# Altium project LIDO-HW_2022-04_V01.PrjPcb
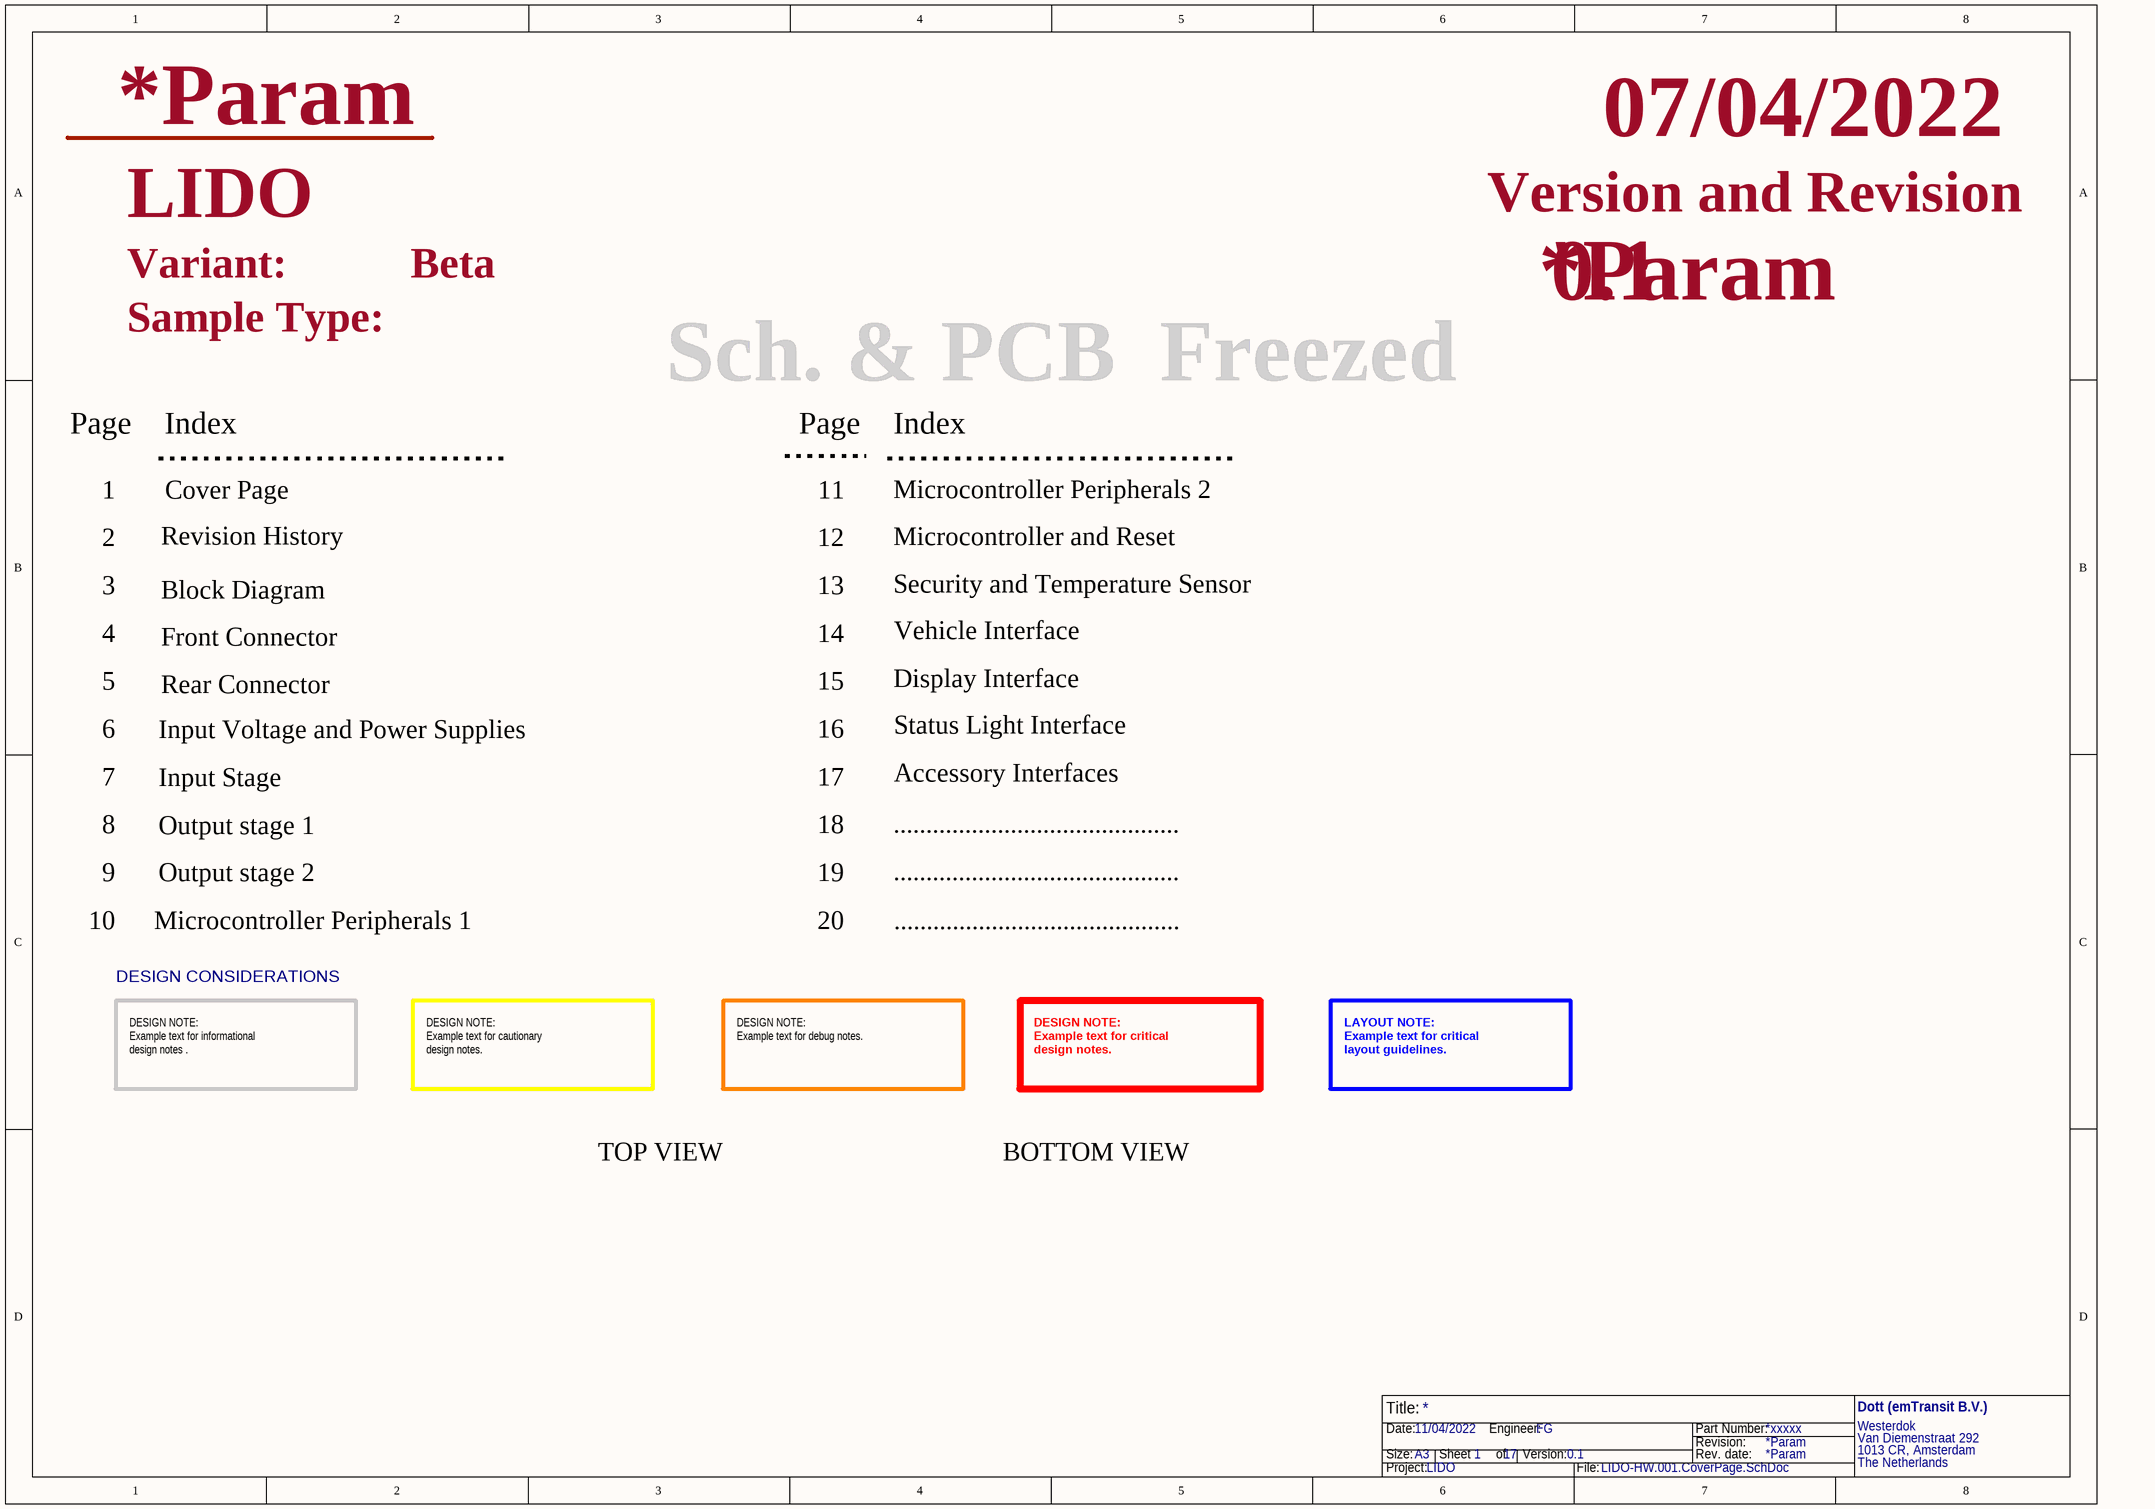
[diagram p0: LIDO-HW.001.CoverPage.SchDoc]
Company_Name: Dott (emTransit B.V.); CompanyAddress1: Westerdok; CompanyAddress2: Van Diemenstraat 292; CompanyAddress3: 1013 CR, Amsterdam; CompanyAddress4: The Netherlands; HardwareDesigner: FG; HardwareDesignerAbb: *Param; MainProjectName: *Param; PopulateLabel: *Param; Project_Version: 0.1; Project_VersionDate: 11/04/2022; ProjectBoardName: LIDO; ProjectNumber: *xxxxx; ProjectRevision: *Param; ProjectRevisionDate: *Param; ProjectStartDate: 07/04/2022; ProjectVariant: Beta; ReleaseDate: *Param; Reviewer: *Param; ReviewerAbb: *Param
14 sheets, 260 parts. Net scope: flat (ports and power ports of the same name join across sheets).
Board file: LIDO-HW_2022-04_V01.PcbDoc
Sheets:
  LIDO-HW.001.CoverPage.SchDoc
  LIDO-HW.002.BlockDiagram.SchDoc
  LIDO-HW.003.RevisionHistory.SchDoc
  LIDO-HW.004.RevisionHistory.SchDoc
  LIDO-HW.100.Connectors_1.SchDoc
  LIDO-HW.100.Connectors_2.SchDoc
  LIDO-HW.100.Page_3.SchDoc
  LIDO-HW.100.Page_4.SchDoc
  LIDO-HW.100.Page_5.SchDoc
  LIDO-HW.100.Page_6.SchDoc
  LIDO-HW.100.Page_7.SchDoc
  LIDO-HW.100.Page_8.SchDoc
  LIDO-HW.100.Page_9.SchDoc
  LIDO-HW.100.Page_10.SchDoc

## Sheet LIDO-HW.001.CoverPage.SchDoc
size A3; CompanyName: EST-Floattech; DrawnBy: RR; Organization: EST-Floattech; Address2: Zandsteen 1; Address3: 2132 MZ; Address4: Hoofddorp; DocumentNumber: 21xxx; Revision: 1.0; SheetNumber: 1; SheetTotal: 17

### Notes on the sheet
- Version and Revision
- Variant:
- Sample Type:
- Page
- Index
- Sch. & PCB  Freezed
- 1
- Cover Page
- 11
- Microcontroller Peripherals 2
- 2
- Revision History
- 12
- Microcontroller and Reset
- 3
- 4
- Block Diagram
- Front Connector
- 13
- 14
- Security and Temperature Sensor
- Vehicle Interface
- 5
- Rear Connector
- 15
- Display Interface
- 6
- 7
- Input Voltage and Power Supplies
- Input Stage
- 16
- 17
- Status Light Interface
- Accessory Interfaces
- 8
- Output stage 1
- 18
- ............................................
- 9
- Output stage 2
- 19
- DESIGN CONSIDERATIONS
- 10
- Microcontroller Peripherals 1
- 20
- DESIGN NOTE:
  Example text for informational
  design notes .
- DESIGN NOTE:
  Example text for cautionary
  design notes.
- DESIGN NOTE:
  Example text for debug notes.
- DESIGN NOTE:
  Example text for critical
  design notes.
- LAYOUT NOTE:
  Example text for critical
  layout guidelines.
- TOP VIEW
- BOTTOM VIEW
- Title:
- Size:
- Date:
- A3
- Sheet       of
- Engineer:
- Version:
- Part Number:
- Revision:
- Rev. date:
- Project:
- File:

## Sheet LIDO-HW.002.BlockDiagram.SchDoc
size A3; CompanyName: EST-Floattech; DrawnBy: RR; Organization: EST-Floattech; Address2: Zandsteen 1; Address3: 2132 MZ; Address4: Hoofddorp; DocumentNumber: 21xxx; Revision: 1.0; SheetNumber: 2; SheetTotal: 18
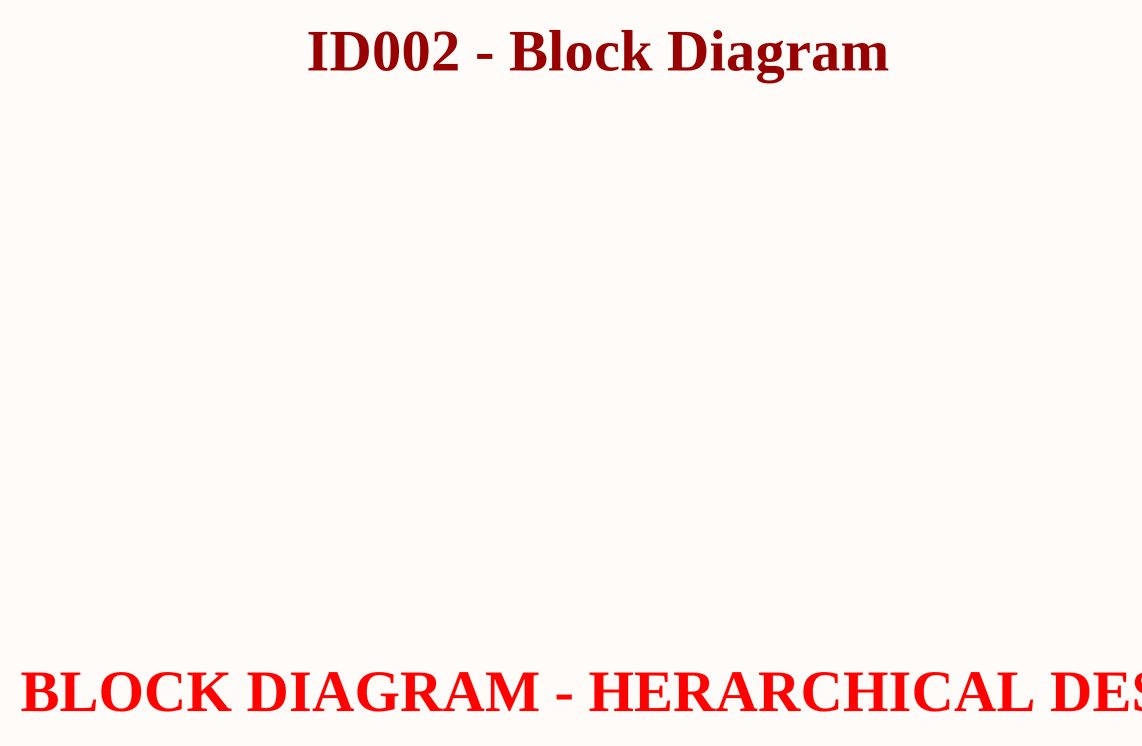
[diagram p1: LIDO-HW.002.BlockDiagram.SchDoc]

### Notes on the sheet
- ID002 - Block Diagram
- BLOCK DIAGRAM - HERARCHICAL DESIGN
- Title:
- Size:
- Date:
- A3
- Sheet       of
- Engineer:
- Version:
- Part Number:
- Revision:
- Rev. date:
- Project:
- File:

## Sheet LIDO-HW.003.RevisionHistory.SchDoc
size A3; CompanyName: EST-Floattech; DrawnBy: RR; Organization: EST-Floattech; Address2: Zandsteen 1; Address3: 2132 MZ; Address4: Hoofddorp; DocumentNumber: 21xxx; Revision: 1.0; SheetNumber: 3; SheetTotal: 18
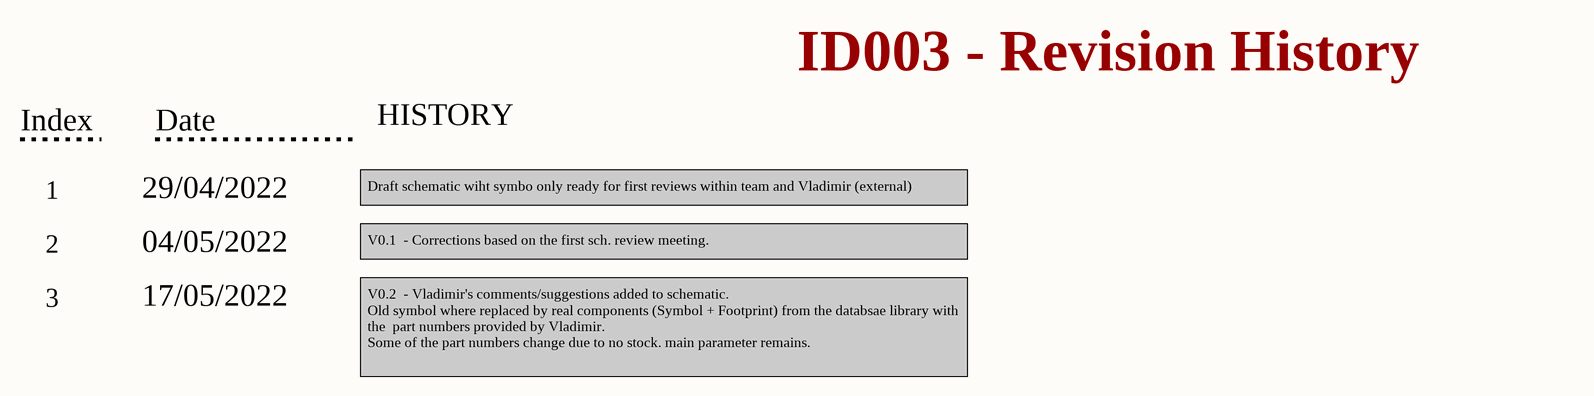
[diagram p2: LIDO-HW.003.RevisionHistory.SchDoc]

### Notes on the sheet
- Index
- Date
- HISTORY
- ID003 - Revision History
- 1
- 29/04/2022
- Draft schematic wiht symbo only ready for first reviews within team and Vladimir (external)
- 2
- 04/05/2022
- V0.1  - Corrections based on the first sch. review meeting.
- 3
- 17/05/2022
- V0.2  - Vladimir's comments/suggestions added to schematic.
  Old symbol where replaced by real components (Symbol + Footprint) from the databsae library with the  part numbers provided by Vladimir.
  Some of the part numbers change due to no stock. main parameter remains.
- Title:
- Size:
- Date:
- A3
- Sheet       of
- Engineer:
- Version:
- Part Number:
- Revision:
- Rev. date:
- Project:
- File:

## Sheet LIDO-HW.004.RevisionHistory.SchDoc
size A3; CompanyName: EST-Floattech; DrawnBy: RR; Organization: EST-Floattech; Address2: Zandsteen 1; Address3: 2132 MZ; Address4: Hoofddorp; DocumentNumber: 21xxx; Revision: 1.0; SheetNumber: 4; SheetTotal: 4
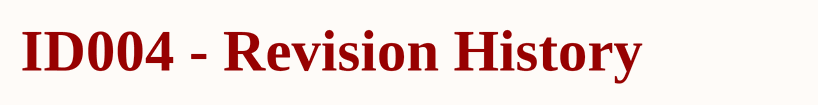
[diagram p3: LIDO-HW.004.RevisionHistory.SchDoc]

### Notes on the sheet
- ID004 - Revision History
- Title:
- Size:
- Date:
- A3
- Sheet       of
- Engineer:
- Version:
- Part Number:
- Revision:
- Rev. date:
- Project:
- File:

## Sheet LIDO-HW.100.Connectors_1.SchDoc
size A3; SheetNumber: 5; SheetTotal: 5
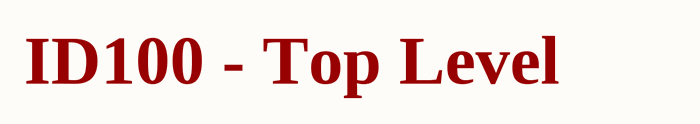
[diagram p4: LIDO-HW.100.Connectors_1.SchDoc]

### Notes on the sheet
- ID100 - Top Level
- Title:
- Size:
- Date:
- A3
- Sheet       of
- Engineer:
- Version:
- Part Number:
- Revision:
- Rev. date:
- Project:
- File:

## Sheet LIDO-HW.100.Connectors_2.SchDoc
size A3; SheetNumber: 6; SheetTotal: 6

### Notes on the sheet
- Title:
- Size:
- Date:
- A3
- Sheet       of
- Engineer:
- Version:
- Part Number:
- Revision:
- Rev. date:
- Project:
- File:

## Sheet LIDO-HW.100.Page_3.SchDoc
size A3; SheetNumber: 7; SheetTotal: 7

### Notes on the sheet
- Title:
- Size:
- Date:
- A3
- Sheet       of
- Engineer:
- Version:
- Part Number:
- Revision:
- Rev. date:
- Project:
- File:

## Sheet LIDO-HW.100.Page_4.SchDoc
size A3; SheetNumber: 8; SheetTotal: 8

### Notes on the sheet
- Title:
- Size:
- Date:
- A3
- Sheet       of
- Engineer:
- Version:
- Part Number:
- Revision:
- Rev. date:
- Project:
- File:

## Sheet LIDO-HW.100.Page_5.SchDoc
size A3; SheetNumber: 9; SheetTotal: 14
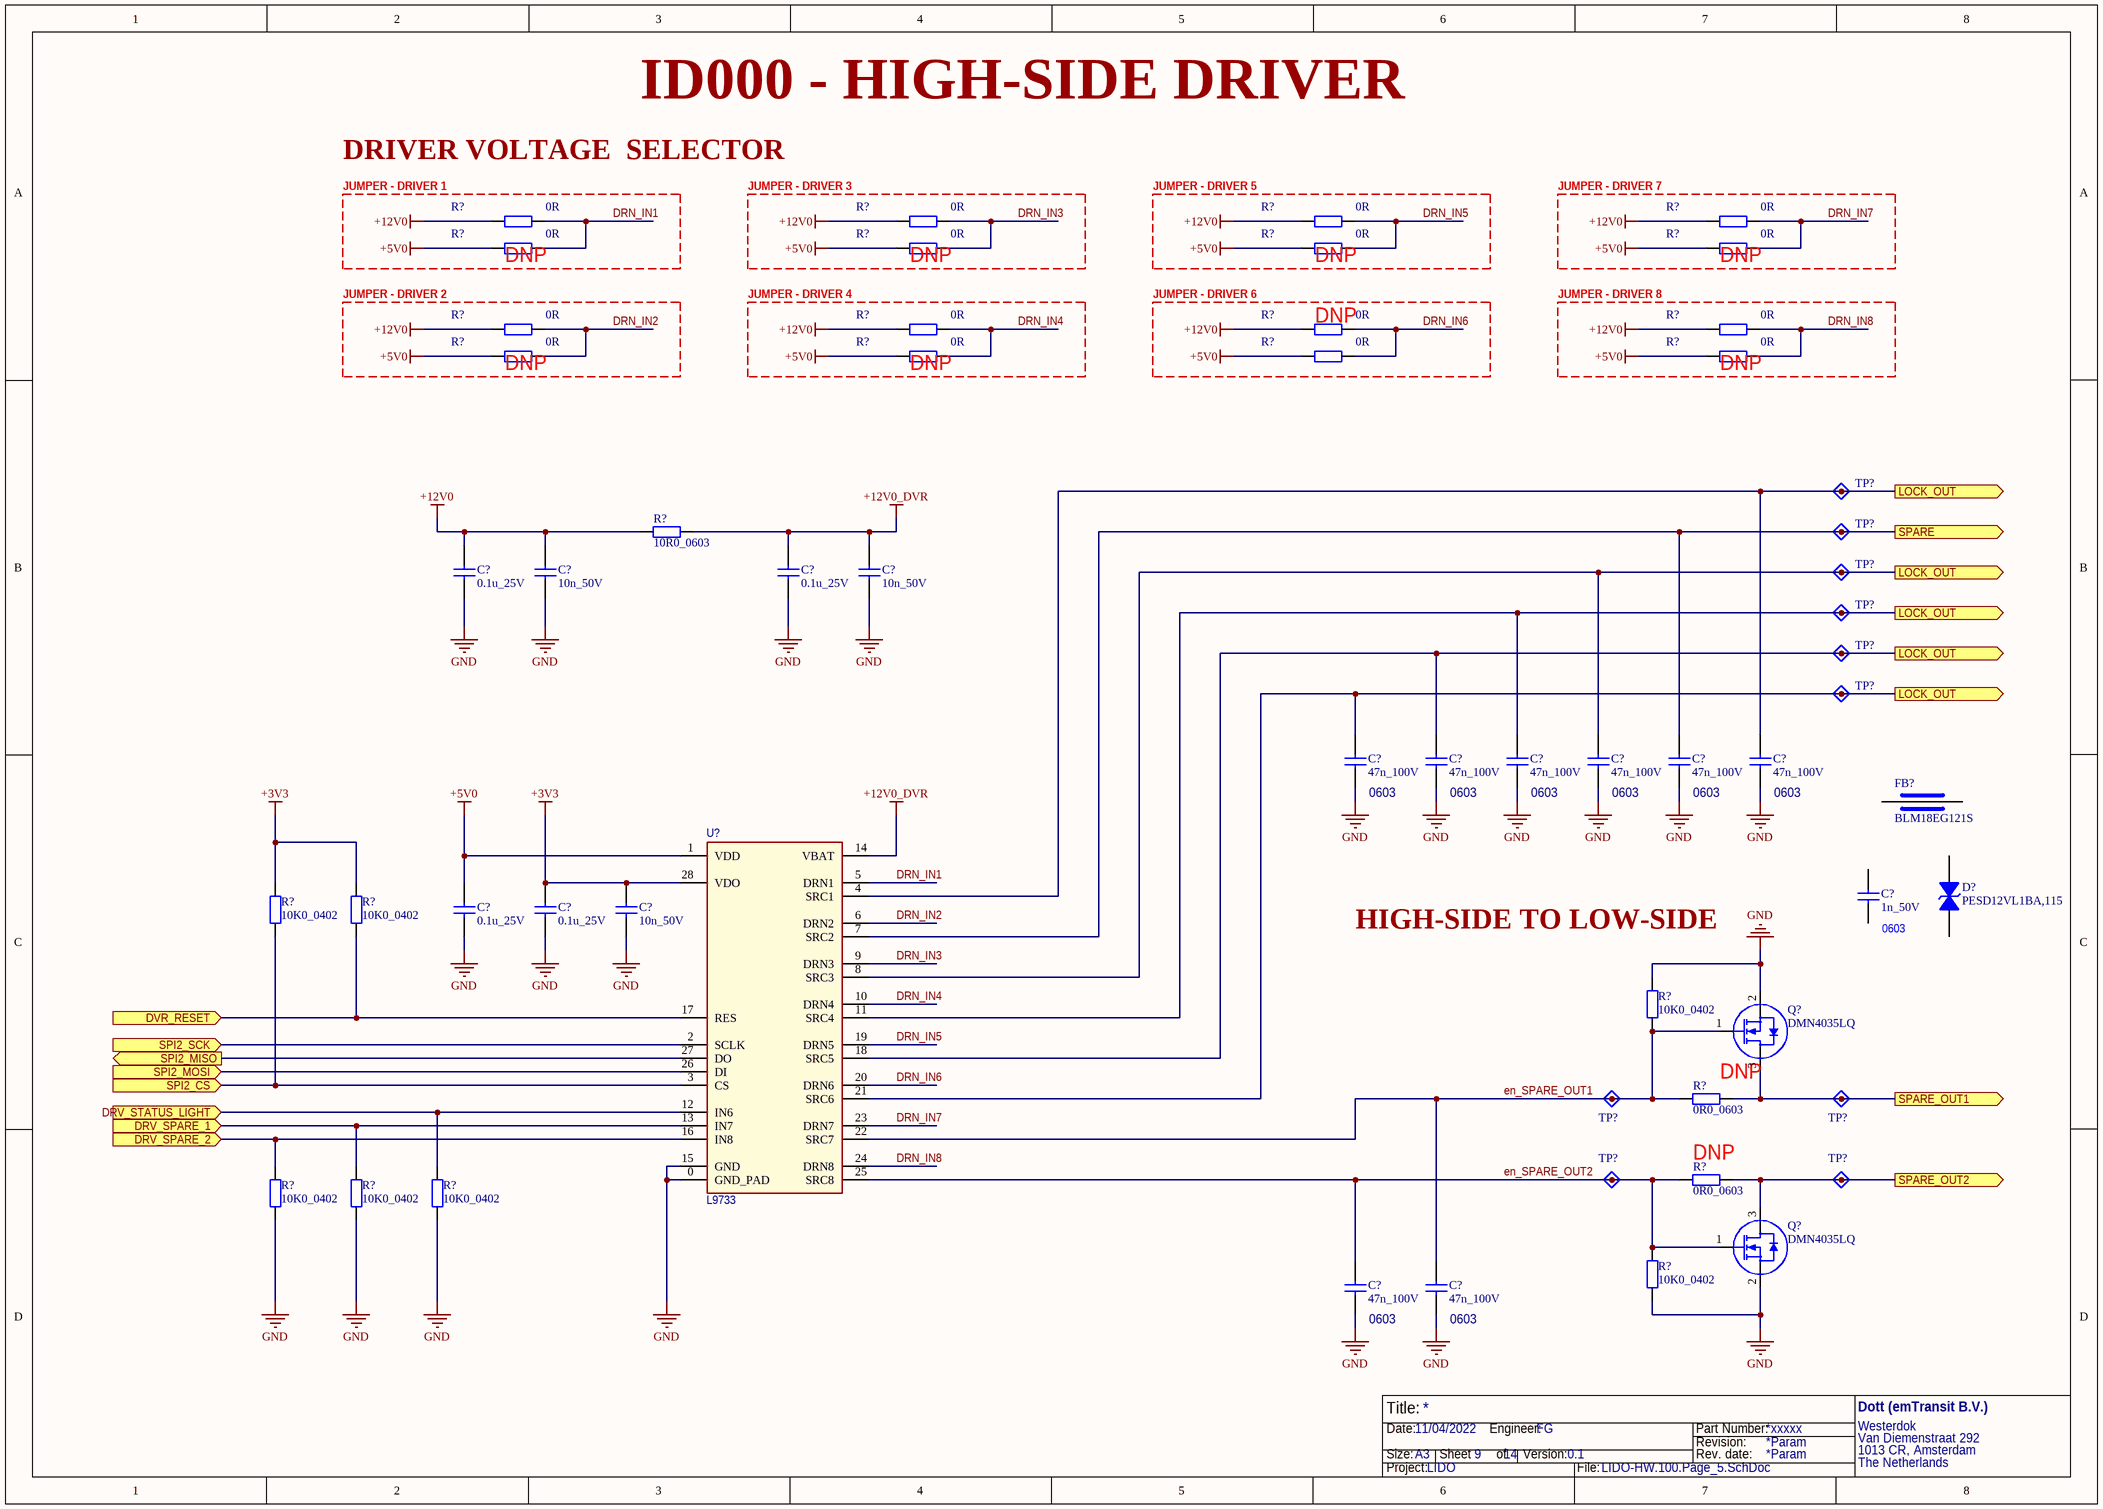
[diagram p5: LIDO-HW.100.Page_5.SchDoc]

### Parts
(Parts that share a designator on the sheet are numbered #1, #2 ... from top to bottom, then left to right.)
C?#1  0.1u_25V
C?#2  10n_50V
C?#3  0.1u_25V
C?#4  10n_50V
C?#5  47n_100V
C?#6  47n_100V
C?#7  47n_100V
C?#8  47n_100V
C?#9  47n_100V
C?#10  47n_100V
C?#11  1n_50V
C?#12  0.1u_25V
C?#13  0.1u_25V
C?#14  10n_50V
C?#15  47n_100V
C?#16  47n_100V
D?#1  PESD12VL1BA,115
FB?#1  BLM18EG121S
Q?#1  DMN4035LQ
Q?#2  DMN4035LQ
R?#1  0R
R?#2  0R
R?#3  0R
R?#4  0R
R?#5  0R
R?#6  0R
R?#7  0R
R?#8  0R
R?#9  0R
R?#10  0R
R?#11  0R
R?#12  0R
R?#13  0R
R?#14  0R
R?#15  0R
R?#16  0R
R?#17  10R0_0603
R?#18  10K0_0402
R?#19  10K0_0402
R?#20  10K0_0402
R?#21  0R0_0603
R?#22  0R0_0603
R?#23  10K0_0402
R?#24  10K0_0402
R?#25  10K0_0402
R?#26  10K0_0402
TP?#1  TestPoint_A  (value not drawn)  (no BOM)
TP?#2  TestPoint_A  (value not drawn)  (no BOM)
TP?#3  TestPoint_A  (value not drawn)  (no BOM)
TP?#4  TestPoint_A  (value not drawn)  (no BOM)
TP?#5  TestPoint_A  (value not drawn)  (no BOM)
TP?#6  TestPoint_A  (value not drawn)  (no BOM)
TP?#7  TestPoint_A  (value not drawn)  (no BOM)
TP?#8  TestPoint_A  (value not drawn)  (no BOM)
TP?#9  TestPoint_A  (value not drawn)  (no BOM)
TP?#10  TestPoint_A  (value not drawn)  (no BOM)
U?#1  L9733

### Blocks framed on the sheet
DNP: R?#1 R?#5
DNP: R?#2 R?#6
DNP: R?#3 R?#7
DNP: R?#4 R?#8
DNP: R?#9 R?#13
DNP: R?#10 R?#14
DNP: R?#11 R?#15
DNP: R?#12 R?#16

### Ports
DRV_SPARE_1 (in), DRV_SPARE_2 (in), DRV_STATUS_LIGHT (in), DVR_RESET (in), LOCK_OUT (out), SPARE (out), SPARE_OUT1 (out), SPARE_OUT2 (out), SPI2_CS (in), SPI2_MISO (out), SPI2_MOSI (in), SPI2_SCK (in)

### Nets
+3V3: C?#13.1 C?#14.1 R?#18.1 R?#19.1 U?#1.28(VDO)
+5V0: C?#12.1 R?#5.1 R?#6.1 R?#7.1 R?#8.1 R?#13.1 R?#14.1 R?#15.1 R?#16.1 U?#1.1(VDD)
+12V0: C?#1.1 C?#2.1 R?#1.1 R?#2.1 R?#3.1 R?#4.1 R?#9.1 R?#10.1 R?#11.1 R?#12.1 R?#17.2
+12V0_DVR: C?#3.1 C?#4.1 R?#17.1 U?#1.14(VBAT)
GND: C?#1.2 C?#2.2 C?#3.2 C?#4.2 C?#5.2 C?#6.2 C?#7.2 C?#8.2 C?#9.2 C?#10.2 C?#12.2 C?#13.2 C?#14.2 C?#15.2 C?#16.2 Q?#1.2(S) Q?#2.2(S) R?#20.2 R?#23.2 R?#24.2 R?#25.2 R?#26.2 U?#1.0(GND_PAD) U?#1.15(GND)
DRN_IN1: R?#1.2 R?#5.2 U?#1.5(DRN1)
DRN_IN2: R?#9.2 R?#13.2 U?#1.6(DRN2)
DRN_IN3: R?#2.2 R?#6.2 U?#1.9(DRN3)
DRN_IN4: R?#10.2 R?#14.2 U?#1.10(DRN4)
DRN_IN5: R?#3.2 R?#7.2 U?#1.19(DRN5)
DRN_IN6: R?#11.2 R?#15.2 U?#1.20(DRN6)
DRN_IN7: R?#4.2 R?#8.2 U?#1.23(DRN7)
DRN_IN8: R?#12.2 R?#16.2 U?#1.24(DRN8)
en_SPARE_OUT1: C?#16.1 Q?#1.1(G) R?#20.1 R?#21.2 TP?#7.1(TP) U?#1.22(SRC7)
en_SPARE_OUT2: C?#15.1 Q?#2.1(G) R?#22.2 R?#26.1 TP?#9.1(TP) U?#1.25(SRC8)
NetC?#5_1: C?#5.1 C?#6.1 C?#7.1 C?#8.1 C?#10.1 TP?#1.1(TP) TP?#3.1(TP) TP?#4.1(TP) TP?#5.1(TP) TP?#6.1(TP) U?#1.4(SRC1) U?#1.8(SRC3) U?#1.11(SRC4) U?#1.18(SRC5) U?#1.21(SRC6) ; port LOCK_OUT
NetC?#9_1: C?#9.1 TP?#2.1(TP) U?#1.7(SRC2) ; port SPARE
NetQ?#1_3: Q?#1.3(D) R?#21.1 TP?#8.1(TP) ; port SPARE_OUT1
NetQ?#2_3: Q?#2.3(D) R?#22.1 TP?#10.1(TP) ; port SPARE_OUT2
NetR?#18_2: R?#18.2 U?#1.3(CS) ; port SPI2_CS
NetR?#19_2: R?#19.2 U?#1.17(RES) ; port DVR_RESET
NetR?#23_1: R?#23.1 U?#1.16(IN8) ; port DRV_SPARE_2
NetR?#24_1: R?#24.1 U?#1.13(IN7) ; port DRV_SPARE_1
NetR?#25_1: R?#25.1 U?#1.12(IN6) ; port DRV_STATUS_LIGHT
NetU?#1_2: U?#1.2(SCLK) ; port SPI2_SCK
NetU?#1_26: U?#1.26(DI) ; port SPI2_MOSI
NetU?#1_27: U?#1.27(DO) ; port SPI2_MISO

Not connected (* = marked no-connect by the designer): C?#11 1 2; D?#1 A C; FB?#1 1 2

### Notes on the sheet
- ID000 - HIGH-SIDE DRIVER
- DRIVER VOLTAGE  SELECTOR
- JUMPER - DRIVER 1
- JUMPER - DRIVER 3
- JUMPER - DRIVER 5
- JUMPER - DRIVER 7
- JUMPER - DRIVER 2
- JUMPER - DRIVER 4
- JUMPER - DRIVER 6
- JUMPER - DRIVER 8
- (near C?#5) 0603
- (near C?#6) 0603
- (near C?#7) 0603
- (near C?#8) 0603
- (near C?#9) 0603
- (near C?#10) 0603
- HIGH-SIDE TO LOW-SIDE
- (near C?#11) 0603
- DNP
- (near R?#22) DNP
- (near C?#15) 0603
- (near C?#16) 0603
- Title:
- Size:
- Date:
- A3
- Sheet       of
- Engineer:
- Version:
- Part Number:
- Revision:
- Rev. date:
- Project:
- File:

### Library data of the parts
C?#1-C?#16 = Ceramic: Ceramic CAP Symbol
D?#1 = BI-TVS_DIODE_B: Bidirectional TVS Diode Symbol
FB?#1 = FERRITE_BEAD: Ferrite Bead Symbol
Q?#1 Q?#2 = MOSFET_N_WD_1G_2S_3D: N-Channel MOSFET with Diode
R?#1-R?#26 = Resistor: Resistor Symbol
TP?#1-TP?#10 = TestPoint_A: Test Point Symbol verion A; 00_Name: TP_XXmm; 01_Diameter: 1mm; 02_Layer: *
U?#1 = L9733_A: Power Switch/Driver 1:8 N-Channel 1A PowerSSO-28 Exposed Pad

## Sheet LIDO-HW.100.Page_6.SchDoc
size A3; SheetNumber: 10; SheetTotal: 14
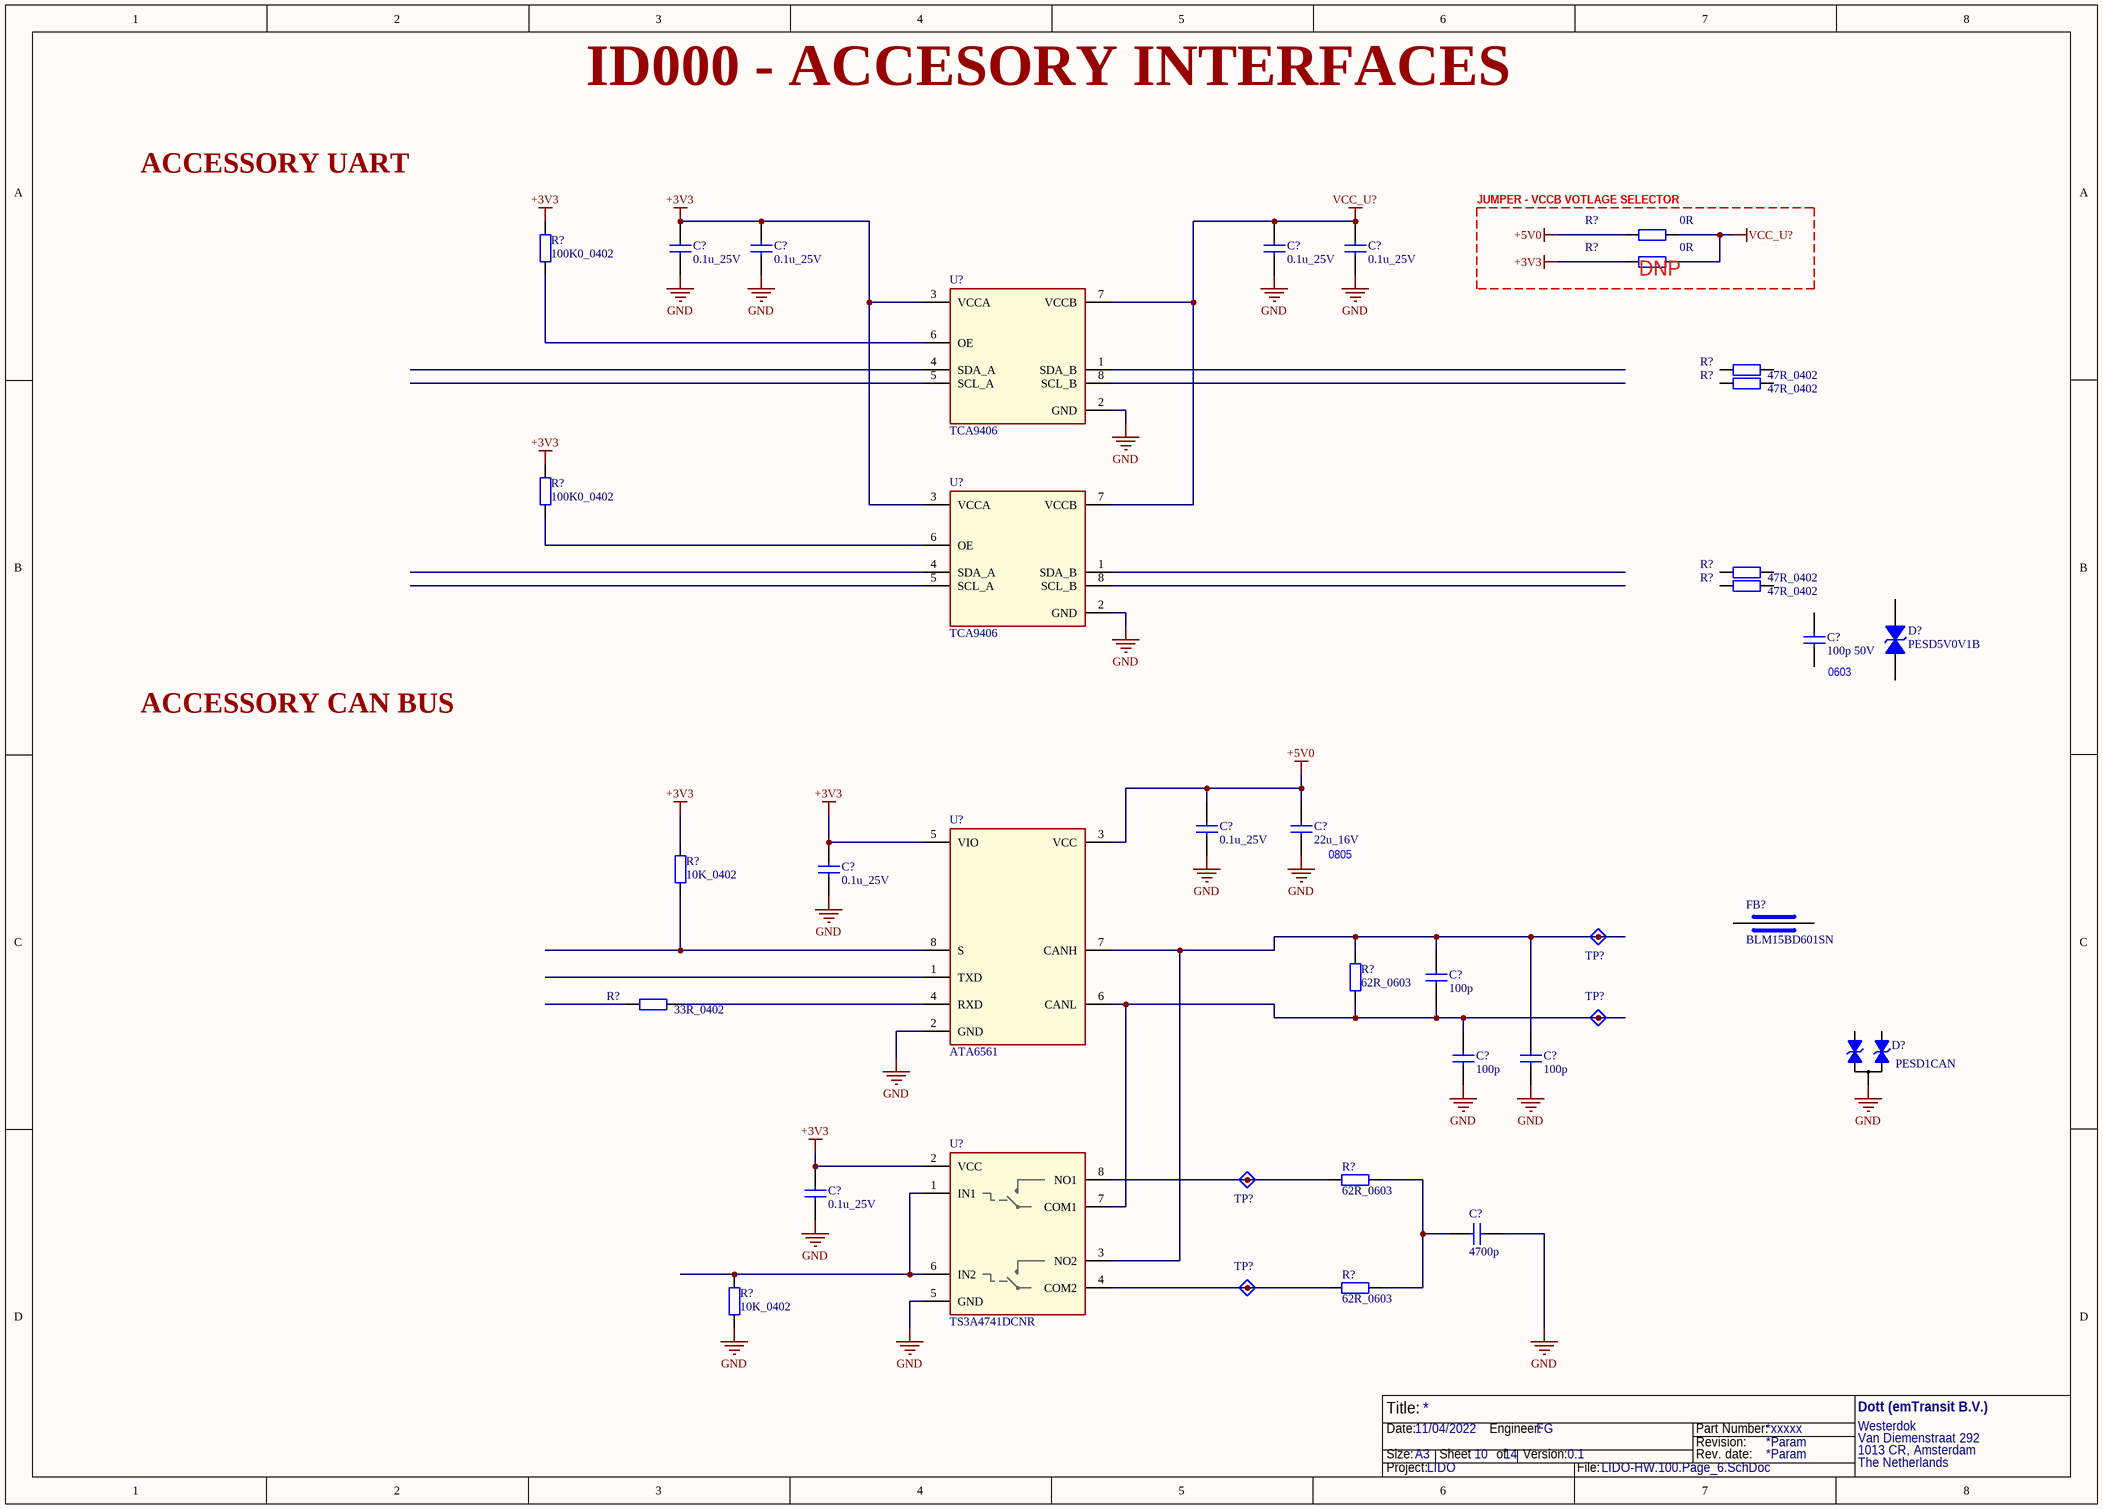
[diagram p6: LIDO-HW.100.Page_6.SchDoc]

### Parts
(Parts that share a designator on the sheet are numbered #1, #2 ... from top to bottom, then left to right.)
C?#17  0.1u_25V
C?#18  0.1u_25V
C?#19  0.1u_25V
C?#20  0.1u_25V
C?#21  100p 50V
C?#22  0.1u_25V
C?#23  22u_16V
C?#24  0.1u_25V
C?#25  100p
C?#26  100p
C?#27  100p
C?#28  0.1u_25V
C?#29  4700p
D?#2  PESD5V0V1B
D?#3  PESD1CAN
FB?#2  BLM15BD601SN
R?#27  0R
R?#28  100K0_0402
R?#29  0R
R?#30  47R_0402
R?#31  47R_0402
R?#32  100K0_0402
R?#33  47R_0402
R?#34  47R_0402
R?#35  10K_0402
R?#36  62R_0603
R?#37  33R_0402
R?#38  62R_0603
R?#39  62R_0603
R?#40  10K_0402
TP?#11  TestPoint_A  (value not drawn)  (no BOM)
TP?#12  TestPoint_A  (value not drawn)  (no BOM)
TP?#13  TestPoint_A  (value not drawn)  (no BOM)
TP?#14  TestPoint_A  (value not drawn)  (no BOM)
U?#2  TCA9406
U?#3  TCA9406
U?#4  ATA6561  [SOIC8P127_490X600X175L83X42N]
U?#5  TS3A4741DCNR  [TSOP65P280X145-8N]

### Blocks framed on the sheet
DNP: R?#27 R?#29

### Nets
+3V3: C?#17.1 C?#18.1 C?#24.1 C?#28.1 R?#28.1 R?#29.1 R?#32.1 R?#35.1 U?#2.3(VCCA) U?#3.3(VCCA) U?#4.5(VIO) U?#5.2(VCC)
+5V0: C?#22.1 C?#23.1 R?#27.1 U?#4.3(VCC)
GND: C?#17.2 C?#18.2 C?#19.2 C?#20.2 C?#22.2 C?#23.2 C?#24.2 C?#26.2 C?#27.1 C?#28.2 C?#29.2 D?#3.3 R?#40.2 U?#2.2(GND) U?#3.2(GND) U?#4.2(GND) U?#5.5(GND)
VCC_U?: C?#19.1 C?#20.1 R?#27.2 R?#29.2 U?#2.7(VCCB) U?#3.7(VCCB)
NetC?#25_1: C?#25.1 C?#27.2 R?#36.1 TP?#11.1(TP) U?#4.7(CANH) U?#5.3(NO2)
NetC?#25_2: C?#25.2 C?#26.1 R?#36.2 TP?#12.1(TP) U?#4.6(CANL) U?#5.7(COM1)
NetC?#29_1: C?#29.1 R?#38.1 R?#39.1
NetR?#28_2: R?#28.2 U?#2.6(OE)
NetR?#32_2: R?#32.2 U?#3.6(OE)
NetR?#35_2: R?#35.2 U?#4.8(S)
NetR?#37_1: R?#37.1 U?#4.4(RXD)
NetR?#38_2: R?#38.2 TP?#13.1(TP) U?#5.8(NO1)
NetR?#39_2: R?#39.2 TP?#14.1(TP) U?#5.4(COM2)
NetR?#40_1: R?#40.1 U?#5.1(IN1) U?#5.6(IN2)

Not connected (* = marked no-connect by the designer): C?#21 1 2; D?#2 A C; D?#3 1 2; FB?#2 1 2; R?#30 1 2; R?#31 1 2; R?#33 1 2; R?#34 1 2; R?#37 2; U?#2 1(SDA_B) 4(SDA_A) 5(SCL_A) 8(SCL_B); U?#3 1(SDA_B) 4(SDA_A) 5(SCL_A) 8(SCL_B); U?#4 1(TXD)

### Notes on the sheet
- ID000 - ACCESORY INTERFACES
- ACCESSORY UART
- (near R?#27) JUMPER - VCCB VOTLAGE SELECTOR
- ACCESSORY CAN BUS
- (near C?#21) 0603
- (near C?#23) 0805
- Title:
- Size:
- Date:
- A3
- Sheet       of
- Engineer:
- Version:
- Part Number:
- Revision:
- Rev. date:
- Project:
- File:

### Library data of the parts
C?#17-C?#29 = Ceramic: Ceramic CAP Symbol
D?#2 = BI-TVS_DIODE_B: Bidirectional TVS Diode Symbol
D?#3 = Double Bi-TVS_B: Double bidirectional ESD protection diodes
FB?#2 = FERRITE_BEAD: Ferrite Bead Symbol
R?#27-R?#40 = Resistor: Resistor Symbol
TP?#11-TP?#14 = TestPoint_A: as TP?#1 on sheet LIDO-HW.100.Page_5; 02_Layer: *
U?#2 U?#3 = TCA9406_A: 2-Bit Bidirectional 1-MHz, I / 2C Bus and SMBus Voltage-Level Translator With 8-kV HBM ESD
U?#4 = ATA6561_A: IC TRANSCEIVER 1/1 8SO; Manufacturer: Microchip Technology; Manufacturer Part Number: ATA6561-GAQW; Designer: Matt Drazenovich; Ratings: RoHS; Reviewed: Dekimo_07-07-2020; Case/Package: 8-SOIC; ComponentType: IC; Design Date: 22-11-2019; Max Operating Temperature: 150°C; Min Operating Temperature: -40°C; Value: ATA6561
U?#5 = TS3A4741D_A: 2 Circuit IC Switch 1:1 900mOhm SOT-23-8; Manufacturer: Texas Instruments; Designer: Matt Drazenovich; Ratings: RoHS; Reviewed: Not Footprint; Case/Package: SOT-23-8; ComponentType: IC; Design Date: 09-09-2021; Manufacturer Part Number: TS3A4741DCNR; Max Operating Temperature: 85°C; Min Operating Temperature: -40°C; Value: TS3A4741DCNR

## Sheet LIDO-HW.100.Page_7.SchDoc
size A3; SheetNumber: 11; SheetTotal: 14
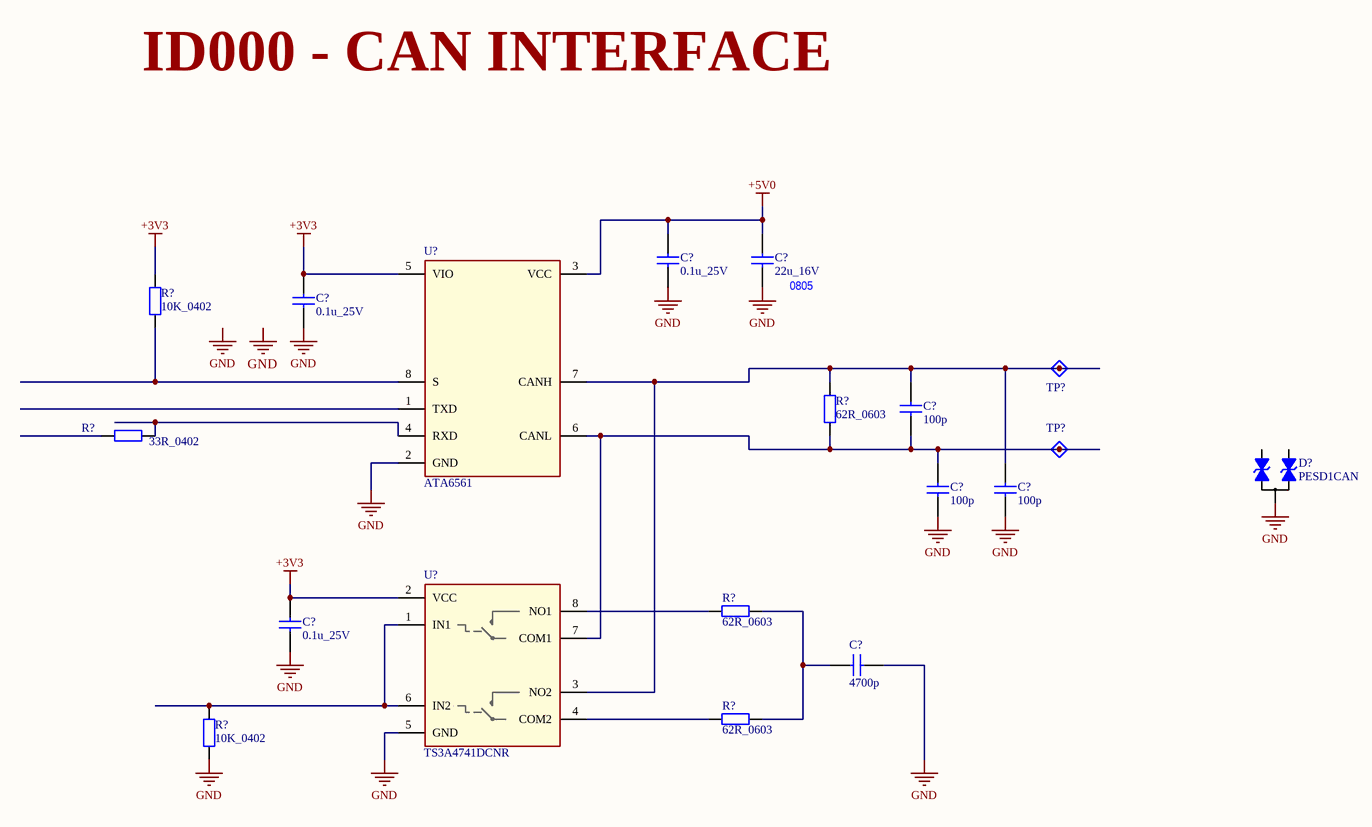
[diagram p7: LIDO-HW.100.Page_7.SchDoc]

### Parts
(Parts that share a designator on the sheet are numbered #1, #2 ... from top to bottom, then left to right.)
C?#30  0.1u_25V
C?#31  22u_16V
C?#32  0.1u_25V
C?#33  100p
C?#34  100p
C?#35  100p
C?#36  0.1u_25V
C?#37  4700p
D?#4  PESD1CAN
R?#41  10K_0402
R?#42  62R_0603
R?#43  33R_0402
R?#44  62R_0603
R?#45  62R_0603
R?#46  10K_0402
TP?#15  TestPoint_A  (value not drawn)  (no BOM)
TP?#16  TestPoint_A  (value not drawn)  (no BOM)
U?#6  ATA6561  [SOIC8P127_490X600X175L83X42N]
U?#7  TS3A4741DCNR  [TSOP65P280X145-8N]

### Nets
+3V3: C?#32.1 C?#36.1 R?#41.1 U?#6.5(VIO) U?#7.2(VCC)
+5V0: C?#30.1 C?#31.1 U?#6.3(VCC)
GND: C?#30.2 C?#31.2 C?#32.2 C?#34.2 C?#35.1 C?#36.2 C?#37.2 D?#4.3 R?#46.2 U?#6.2(GND) U?#7.5(GND)
NetC?#33_1: C?#33.1 C?#35.2 R?#42.1 TP?#15.1(TP) U?#6.7(CANH) U?#7.3(NO2)
NetC?#33_2: C?#33.2 C?#34.1 R?#42.2 TP?#16.1(TP) U?#6.6(CANL) U?#7.7(COM1)
NetC?#37_1: C?#37.1 R?#44.1 R?#45.1
NetR?#41_2: R?#41.2 U?#6.8(S)
NetR?#43_1: R?#43.1 U?#6.4(RXD)
NetR?#44_2: R?#44.2 U?#7.8(NO1)
NetR?#45_2: R?#45.2 U?#7.4(COM2)
NetR?#46_1: R?#46.1 U?#7.1(IN1) U?#7.6(IN2)

Not connected (* = marked no-connect by the designer): D?#4 1 2; R?#43 2; U?#6 1(TXD)

### Notes on the sheet
- ID000 - CAN INTERFACE
- (near C?#31) 0805
- Labels drawn without touching a wire or pin: GND
- Title:
- Size:
- Date:
- A3
- Sheet       of
- Engineer:
- Version:
- Part Number:
- Revision:
- Rev. date:
- Project:
- File:

### Library data of the parts
C?#30-C?#37 = Ceramic: Ceramic CAP Symbol
D?#4 = Double Bi-TVS_B: as D?#3 on sheet LIDO-HW.100.Page_6
R?#41-R?#46 = Resistor: Resistor Symbol
TP?#15 TP?#16 = TestPoint_A: as TP?#1 on sheet LIDO-HW.100.Page_5; 02_Layer: *
U?#6 = ATA6561_A: as U?#4 on sheet LIDO-HW.100.Page_6; Case/Package: 8-SOIC; ComponentType: IC; Design Date: 22-11-2019; Max Operating Temperature: 150°C; Min Operating Temperature: -40°C; Value: ATA6561
U?#7 = TS3A4741D_A: as U?#5 on sheet LIDO-HW.100.Page_6; Case/Package: SOT-23-8; ComponentType: IC; Design Date: 09-09-2021; Manufacturer Part Number: TS3A4741DCNR; Max Operating Temperature: 85°C; Min Operating Temperature: -40°C; Value: TS3A4741DCNR

## Sheet LIDO-HW.100.Page_8.SchDoc
size A3; SheetNumber: 12; SheetTotal: 14
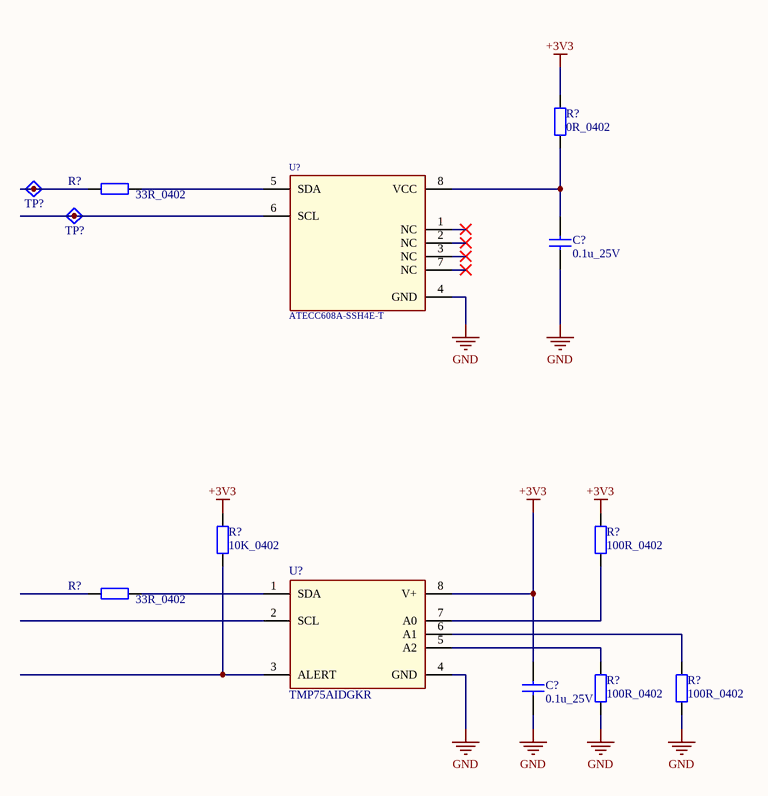
[diagram p8: LIDO-HW.100.Page_8.SchDoc]

### Parts
(Parts that share a designator on the sheet are numbered #1, #2 ... from top to bottom, then left to right.)
C?#38  0.1u_25V
C?#39  0.1u_25V
R?#47  0R_0402
R?#48  33R_0402
R?#49  10K_0402
R?#50  100R_0402
R?#51  33R_0402
R?#52  100R_0402
R?#53  100R_0402
TP?#17  TestPoint_A  (value not drawn)  (no BOM)
TP?#18  TestPoint_A  (value not drawn)  (no BOM)
U?#8  ATECC608A-SSH4E-T  [SOIC8P127_490X600X175L83X42N]
U?#9  TMP75AIDGKR  [SOP8P65_300X490X110L55X31N]

### Nets
+3V3: C?#39.1 R?#47.2 R?#49.1 R?#50.1 U?#9.8(V+)
GND: C?#38.2 C?#39.2 R?#52.2 R?#53.2 U?#8.4(GND) U?#9.4(GND)
NetC?#38_1: C?#38.1 R?#47.1 U?#8.8(VCC)
NetR?#48_1: R?#48.1 U?#8.5(SDA)
NetR?#48_2: R?#48.2 TP?#17.1(TP)
NetR?#49_2: R?#49.2 U?#9.3(ALERT)
NetR?#50_2: R?#50.2 U?#9.7(A0)
NetR?#51_1: R?#51.1 U?#9.1(SDA)
NetR?#52_1: R?#52.1 U?#9.5(A2)
NetR?#53_1: R?#53.1 U?#9.6(A1)
NetTP?#18_1: TP?#18.1(TP) U?#8.6(SCL)

Not connected (* = marked no-connect by the designer): R?#51 2; U?#8 1(NC)* 2(NC)* 3(NC)* 7(NC)*; U?#9 2(SCL)

### Notes on the sheet
- Title:
- Size:
- Date:
- A3
- Sheet       of
- Engineer:
- Version:
- Part Number:
- Revision:
- Rev. date:
- Project:
- File:

### Library data of the parts
C?#38 C?#39 = Ceramic: Ceramic CAP Symbol
R?#47-R?#53 = Resistor: Resistor Symbol
TP?#17 TP?#18 = TestPoint_A: as TP?#1 on sheet LIDO-HW.100.Page_5; 02_Layer: *
U?#8 = ATECC608A-SSHDA_A: IC AUTHENTICATION CHIP 8SOIC, custom for Dott; Manufacturer: Microchip Technology; Designer: Dekimo; Ratings: RoHS; Reviewed: Dekimo_30-06-2020; Case/Package: 8-SOIC; ComponentType: IC; Design Date: N/A; Manufacturer Part Number: ATECC608A-SSH4E-T; Max Operating Temperature: 85°C; Min Operating Temperature: -40°C; Value: ATECC608A-SSH4E-T
U?#9 = TMP75AIDGKR_A: Temperature Sensor Digital, Local -40°C ~ 125°C 11 b 8-VSSOP; Manufacturer: Texas Instruments; Designer: Matt Drazenovich; Ratings: RoHS; Reviewed: Dekimo_07-07-2020; Case/Package: 8-VSSOP; ComponentType: IC; Manufacturer Part Number: TMP75AIDGKR; Max Operating Temperature: 127°C; Min Operating Temperature: -40°C; Value: TMP75AIDGKR; Design Date: 03-07-2020

## Sheet LIDO-HW.100.Page_9.SchDoc
size A3; SheetNumber: 13; SheetTotal: 14
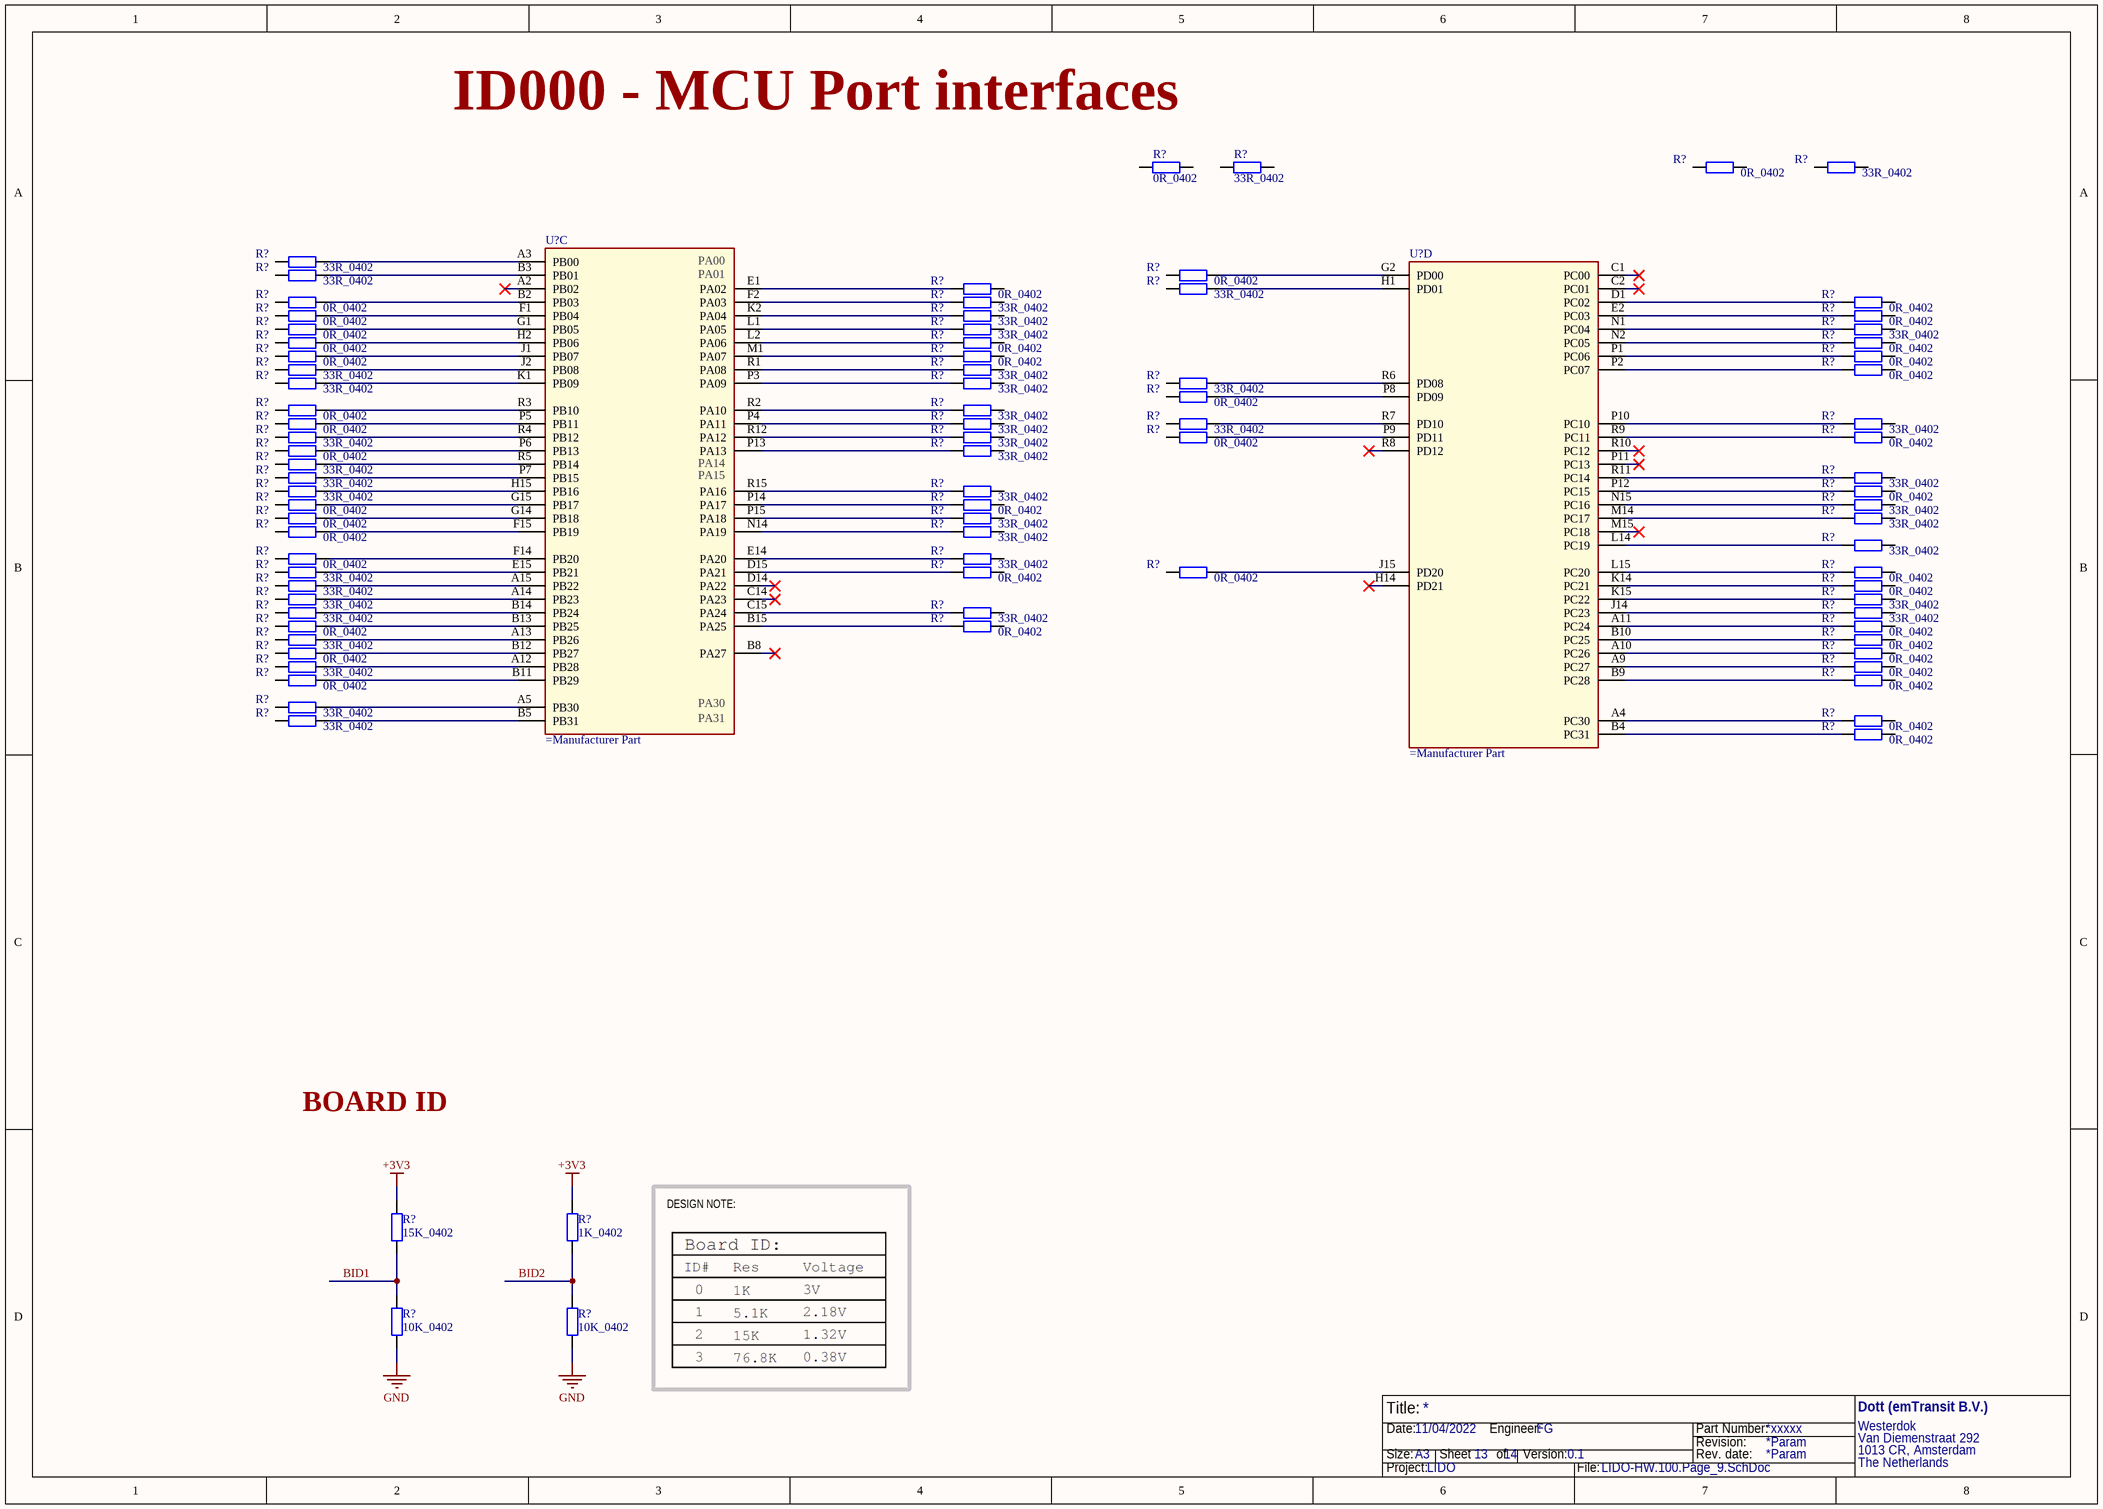
[diagram p9: LIDO-HW.100.Page_9.SchDoc]

### Parts
(Parts that share a designator on the sheet are numbered #1, #2 ... from top to bottom, then left to right.)
R?#54  0R_0402
R?#55  33R_0402
R?#56  0R_0402
R?#57  33R_0402
R?#58  33R_0402
R?#59  33R_0402
R?#60  0R_0402
R?#61  0R_0402
R?#62  33R_0402
R?#63  0R_0402
R?#64  33R_0402
R?#65  0R_0402
R?#66  0R_0402
R?#67  33R_0402
R?#68  0R_0402
R?#69  0R_0402
R?#70  33R_0402
R?#71  33R_0402
R?#72  0R_0402
R?#73  0R_0402
R?#74  0R_0402
R?#75  0R_0402
R?#76  0R_0402
R?#77  0R_0402
R?#78  33R_0402
R?#79  33R_0402
R?#80  0R_0402
R?#81  33R_0402
R?#82  33R_0402
R?#83  33R_0402
R?#84  0R_0402
R?#85  0R_0402
R?#86  33R_0402
R?#87  0R_0402
R?#88  33R_0402
R?#89  33R_0402
R?#90  33R_0402
R?#91  33R_0402
R?#92  33R_0402
R?#93  0R_0402
R?#94  0R_0402
R?#95  0R_0402
R?#96  33R_0402
R?#97  33R_0402
R?#98  33R_0402
R?#99  33R_0402
R?#100  33R_0402
R?#101  33R_0402
R?#102  0R_0402
R?#103  0R_0402
R?#104  0R_0402
R?#105  33R_0402
R?#106  0R_0402
R?#107  33R_0402
R?#108  33R_0402
R?#109  0R_0402
R?#110  33R_0402
R?#111  33R_0402
R?#112  0R_0402
R?#113  33R_0402
R?#114  33R_0402
R?#115  0R_0402
R?#116  0R_0402
R?#117  0R_0402
R?#118  33R_0402
R?#119  0R_0402
R?#120  33R_0402
R?#121  33R_0402
R?#122  33R_0402
R?#123  33R_0402
R?#124  33R_0402
R?#125  0R_0402
R?#126  0R_0402
R?#127  0R_0402
R?#128  33R_0402
R?#129  0R_0402
R?#130  0R_0402
R?#131  0R_0402
R?#132  33R_0402
R?#133  0R_0402
R?#134  0R_0402
R?#135  0R_0402
R?#136  33R_0402
R?#137  33R_0402
R?#138  0R_0402
R?#139  0R_0402
R?#140  15K_0402
R?#141  1K_0402
R?#142  10K_0402
R?#143  10K_0402
U?#10  (no value)  (part C of 4)
U?#11  (no value)  (part D of 4)

### Nets
+3V3: R?#140.2 R?#141.2
GND: R?#142.1 R?#143.1
BID1: R?#140.1 R?#142.2
BID2: R?#141.1 R?#143.2
NetR?#58_1: R?#58.1 U?#10.A3(PB00)
NetR?#59_1: R?#59.1 U?#10.B3(PB01)
NetR?#60_1: R?#60.1 U?#11.G2(PD00)
NetR?#61_2: R?#61.2 U?#10.E1(PA02)
NetR?#62_1: R?#62.1 U?#11.H1(PD01)
NetR?#63_1: R?#63.1 U?#10.B2(PB03)
NetR?#64_2: R?#64.2 U?#10.F2(PA03)
NetR?#65_2: R?#65.2 U?#11.D1(PC02)
NetR?#66_1: R?#66.1 U?#10.F1(PB04)
NetR?#67_2: R?#67.2 U?#10.K2(PA04)
NetR?#68_2: R?#68.2 U?#11.E2(PC03)
NetR?#69_1: R?#69.1 U?#10.G1(PB05)
NetR?#70_2: R?#70.2 U?#10.L1(PA05)
NetR?#71_2: R?#71.2 U?#11.N1(PC04)
NetR?#72_1: R?#72.1 U?#10.H2(PB06)
NetR?#73_2: R?#73.2 U?#10.L2(PA06)
NetR?#74_2: R?#74.2 U?#11.N2(PC05)
NetR?#75_1: R?#75.1 U?#10.J1(PB07)
NetR?#76_2: R?#76.2 U?#10.M1(PA07)
NetR?#77_2: R?#77.2 U?#11.P1(PC06)
NetR?#78_1: R?#78.1 U?#10.J2(PB08)
NetR?#79_2: R?#79.2 U?#10.R1(PA08)
NetR?#80_2: R?#80.2 U?#11.P2(PC07)
NetR?#81_1: R?#81.1 U?#10.K1(PB09)
NetR?#82_2: R?#82.2 U?#10.P3(PA09)
NetR?#83_1: R?#83.1 U?#11.R6(PD08)
NetR?#84_1: R?#84.1 U?#11.P8(PD09)
NetR?#85_1: R?#85.1 U?#10.R3(PB10)
NetR?#86_2: R?#86.2 U?#10.R2(PA10)
NetR?#87_1: R?#87.1 U?#10.P5(PB11)
NetR?#88_2: R?#88.2 U?#10.P4(PA11)
NetR?#89_1: R?#89.1 U?#11.R7(PD10)
NetR?#90_2: R?#90.2 U?#11.P10(PC10)
NetR?#91_1: R?#91.1 U?#10.R4(PB12)
NetR?#92_2: R?#92.2 U?#10.R12(PA12)
NetR?#93_1: R?#93.1 U?#11.P9(PD11)
NetR?#94_2: R?#94.2 U?#11.R9(PC11)
NetR?#95_1: R?#95.1 U?#10.P6(PB13)
NetR?#96_2: R?#96.2 U?#10.P13(PA13)
NetR?#97_1: R?#97.1 U?#10.R5(PB14)
NetR?#98_1: R?#98.1 U?#10.P7(PB15)
NetR?#99_2: R?#99.2 U?#11.R11(PC14)
NetR?#100_1: R?#100.1 U?#10.H15(PB16)
NetR?#101_2: R?#101.2 U?#10.R15(PA16)
NetR?#102_2: R?#102.2 U?#11.P12(PC15)
NetR?#103_1: R?#103.1 U?#10.G15(PB17)
NetR?#104_2: R?#104.2 U?#10.P14(PA17)
NetR?#105_2: R?#105.2 U?#11.N15(PC16)
NetR?#106_1: R?#106.1 U?#10.G14(PB18)
NetR?#107_2: R?#107.2 U?#10.P15(PA18)
NetR?#108_2: R?#108.2 U?#11.M14(PC17)
NetR?#109_1: R?#109.1 U?#10.F15(PB19)
NetR?#110_2: R?#110.2 U?#10.N14(PA19)
NetR?#111_2: R?#111.2 U?#11.L14(PC19)
NetR?#112_1: R?#112.1 U?#10.F14(PB20)
NetR?#113_2: R?#113.2 U?#10.E14(PA20)
NetR?#114_1: R?#114.1 U?#10.E15(PB21)
NetR?#115_2: R?#115.2 U?#10.D15(PA21)
NetR?#116_1: R?#116.1 U?#11.J15(PD20)
NetR?#117_2: R?#117.2 U?#11.L15(PC20)
NetR?#118_1: R?#118.1 U?#10.A15(PB22)
NetR?#119_2: R?#119.2 U?#11.K14(PC21)
NetR?#120_1: R?#120.1 U?#10.A14(PB23)
NetR?#121_2: R?#121.2 U?#11.K15(PC22)
NetR?#122_1: R?#122.1 U?#10.B14(PB24)
NetR?#123_2: R?#123.2 U?#10.C15(PA24)
NetR?#124_2: R?#124.2 U?#11.J14(PC23)
NetR?#125_1: R?#125.1 U?#10.B13(PB25)
NetR?#126_2: R?#126.2 U?#10.B15(PA25)
NetR?#127_2: R?#127.2 U?#11.A11(PC24)
NetR?#128_1: R?#128.1 U?#10.A13(PB26)
NetR?#129_2: R?#129.2 U?#11.B10(PC25)
NetR?#130_1: R?#130.1 U?#10.B12(PB27)
NetR?#131_2: R?#131.2 U?#11.A10(PC26)
NetR?#132_1: R?#132.1 U?#10.A12(PB28)
NetR?#133_2: R?#133.2 U?#11.A9(PC27)
NetR?#134_1: R?#134.1 U?#10.B11(PB29)
NetR?#135_2: R?#135.2 U?#11.B9(PC28)
NetR?#136_1: R?#136.1 U?#10.A5(PB30)
NetR?#137_1: R?#137.1 U?#10.B5(PB31)
NetR?#138_2: R?#138.2 U?#11.A4(PC30)
NetR?#139_2: R?#139.2 U?#11.B4(PC31)

Not connected (* = marked no-connect by the designer): R?#54 1 2; R?#55 1 2; R?#56 1 2; R?#57 1 2; R?#58 2; R?#59 2; R?#60 2; R?#61 1; R?#62 2; R?#63 2; R?#64 1; R?#65 1; R?#66 2; R?#67 1; R?#68 1; R?#69 2; R?#70 1; R?#71 1; R?#72 2; R?#73 1; R?#74 1; R?#75 2; R?#76 1; R?#77 1; R?#78 2; R?#79 1; R?#80 1; R?#81 2; R?#82 1; R?#83 2; R?#84 2; R?#85 2; R?#86 1; R?#87 2; R?#88 1; R?#89 2; R?#90 1; R?#91 2; R?#92 1; R?#93 2; R?#94 1; R?#95 2; R?#96 1; R?#97 2; R?#98 2; R?#99 1; R?#100 2; R?#101 1; R?#102 1; R?#103 2; R?#104 1; R?#105 1; R?#106 2; R?#107 1; R?#108 1; R?#109 2; R?#110 1; R?#111 1; R?#112 2; R?#113 1; R?#114 2; R?#115 1; R?#116 2; R?#117 1; R?#118 2; R?#119 1; R?#120 2; R?#121 1; R?#122 2; R?#123 1; R?#124 1; R?#125 2; R?#126 1; R?#127 1; R?#128 2; R?#129 1; R?#130 2; R?#131 1; R?#132 2; R?#133 1; R?#134 2; R?#135 1; R?#136 2; R?#137 2; R?#138 1; R?#139 1; U?#10 A2(PB02)* B8(PA27)* C14(PA23)* D14(PA22)*; U?#11 C1(PC00)* C2(PC01)* H14(PD21)* M15(PC18)* P11(PC13)* R8(PD12)* R10(PC12)*

### Notes on the sheet
- (near R?#54) ID000 - MCU Port interfaces
- BOARD ID
- DESIGN NOTE:
- Title:
- Size:
- Date:
- A3
- Sheet       of
- Engineer:
- Version:
- Part Number:
- Revision:
- Rev. date:
- Project:
- File:
- (in symbol ATMEL_ATSAME54P20A-CT_A, part C) PA00; PA01; PA14; PA15; PA30; PA31

### Library data of the parts
R?#54-R?#143 = Resistor: Resistor Symbol
U?#10 U?#11 = ATMEL_ATSAME54P20A-CT_A: 32-bit ARM® Cortex®-M4F MCUs with 1 Msps 12-bit ADC, / QSPI, USB, Ethernet, and PTC

## Sheet LIDO-HW.100.Page_10.SchDoc
size A3; SheetNumber: 14; SheetTotal: 14
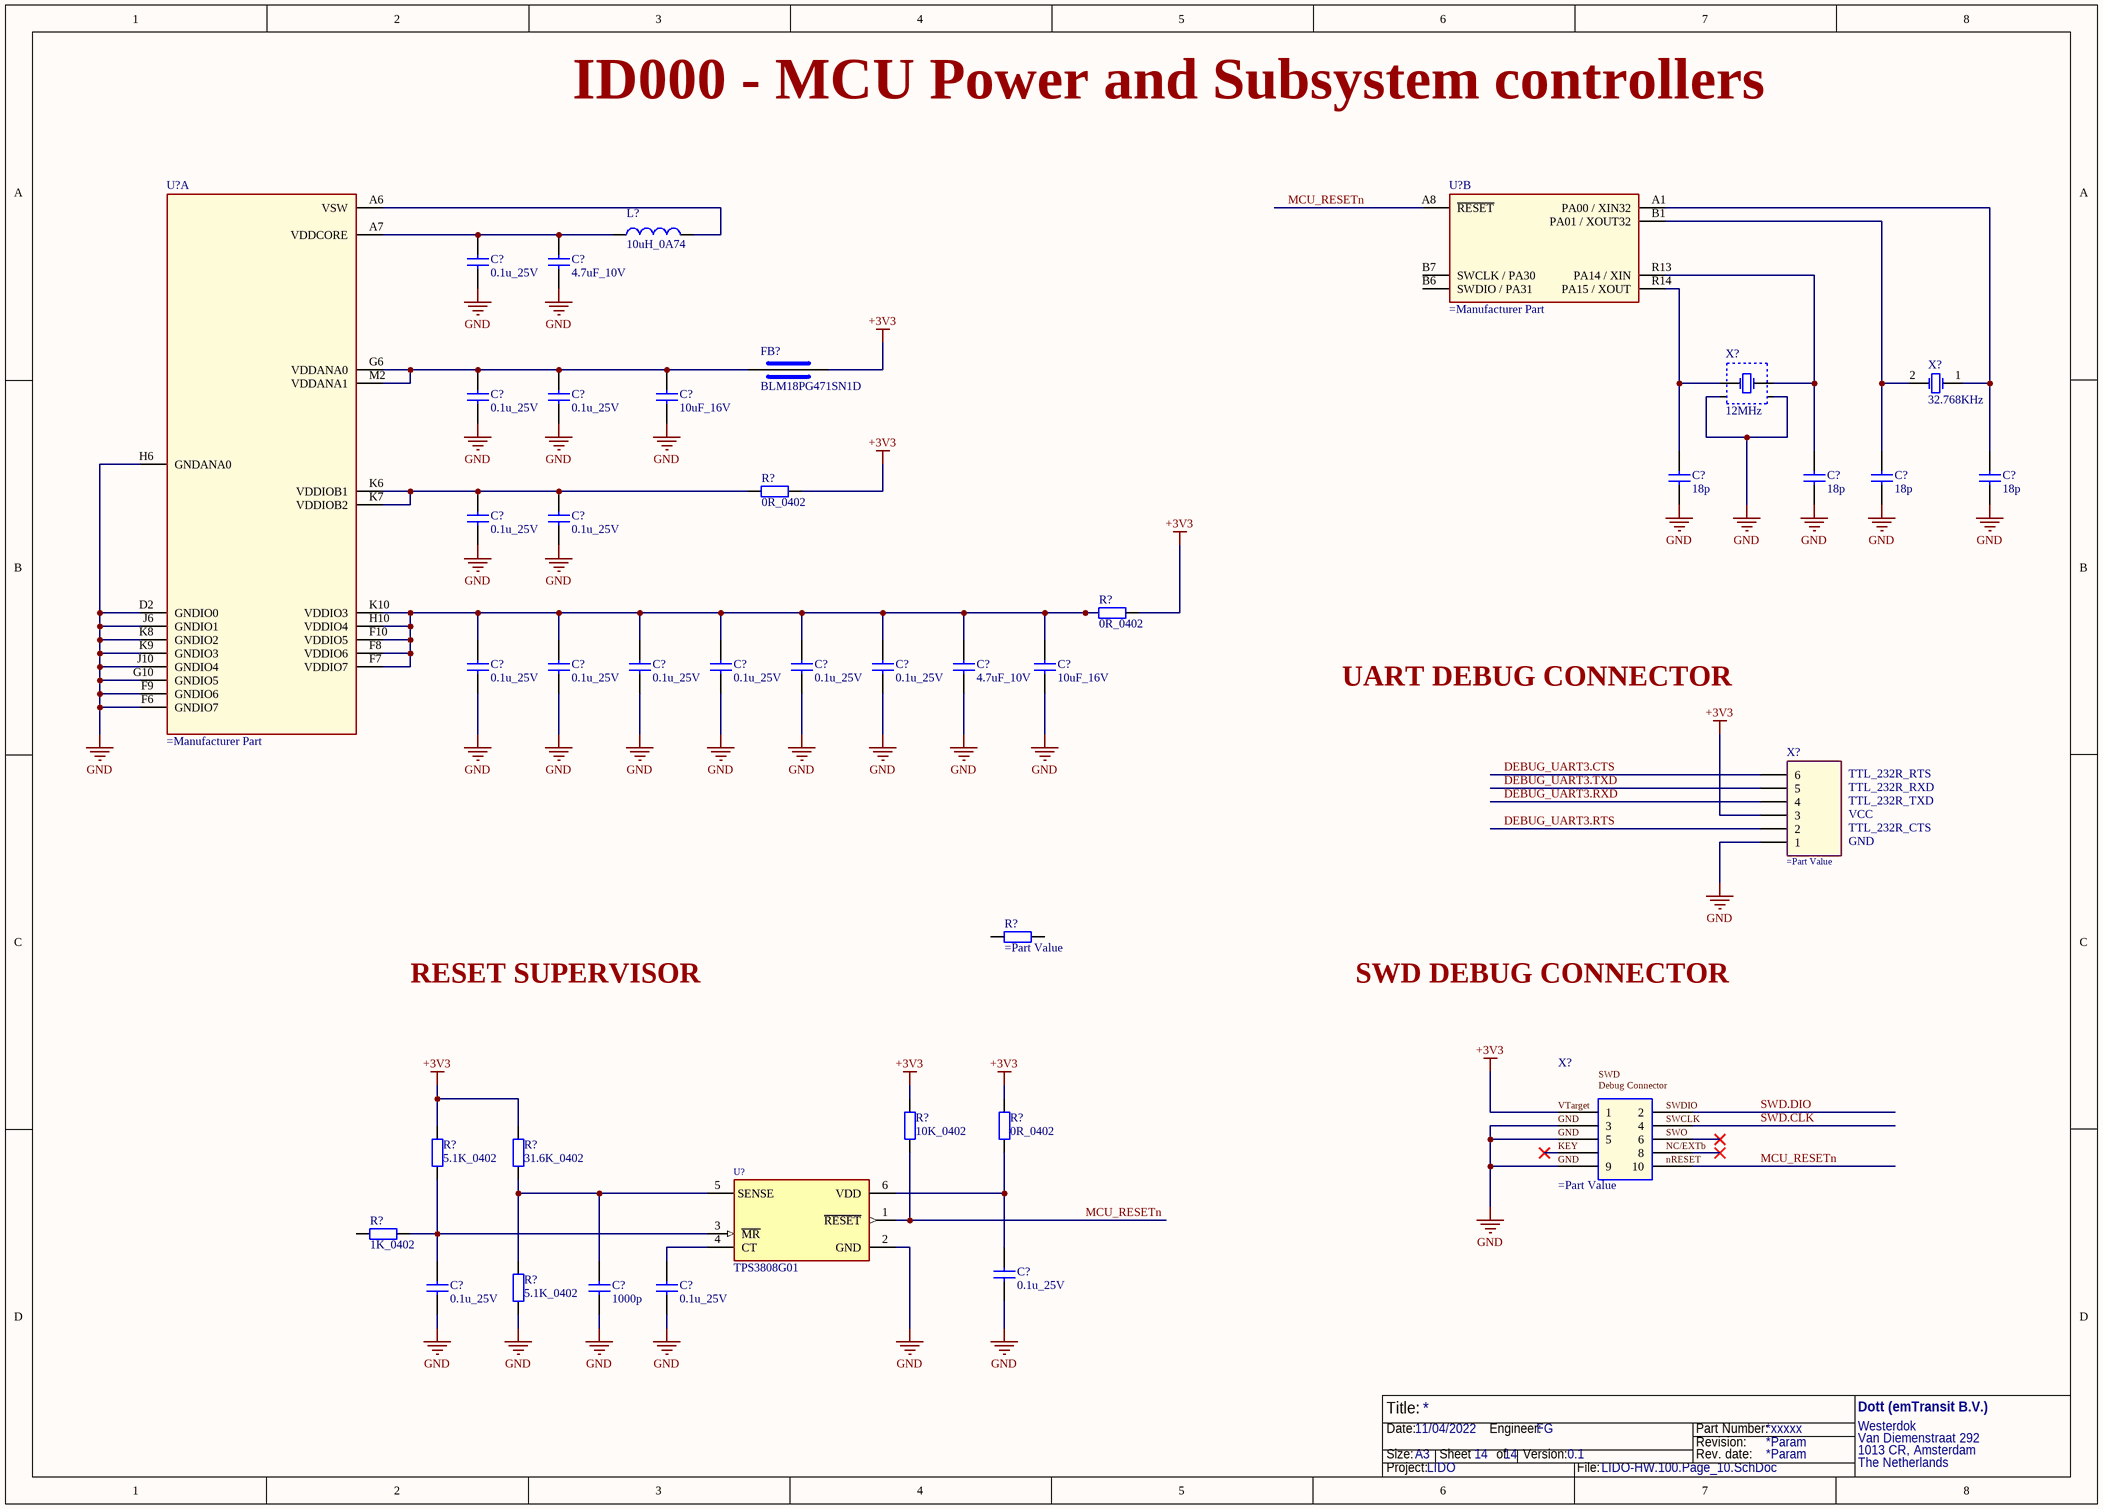
[diagram p10: LIDO-HW.100.Page_10.SchDoc]

### Parts
(Parts that share a designator on the sheet are numbered #1, #2 ... from top to bottom, then left to right.)
C?#40  0.1u_25V
C?#41  4.7uF_10V
C?#42  0.1u_25V
C?#43  0.1u_25V
C?#44  10uF_16V
C?#45  18p
C?#46  18p
C?#47  18p
C?#48  18p
C?#49  0.1u_25V
C?#50  0.1u_25V
C?#51  0.1u_25V
C?#52  0.1u_25V
C?#53  0.1u_25V
C?#54  0.1u_25V
C?#55  0.1u_25V
C?#56  0.1u_25V
C?#57  4.7uF_10V
C?#58  10uF_16V
C?#59  0.1u_25V
C?#60  0.1u_25V
C?#61  1000p
C?#62  0.1u_25V
FB?#3  BLM18PG471SN1D
L?  10uH_0A74
R?#144  0R_0402
R?#145  0R_0402
R?#146  (no value)
R?#147  10K_0402
R?#148  0R_0402
R?#149  5.1K_0402
R?#150  31.6K_0402
R?#151  1K_0402
R?#152  5.1K_0402
U?#12  (no value)  (part B of 4)
U?#13  (no value)  (part A of 4)
U?#14  TPS3808G01  [SOT95P280X145-6N]
X?#1  12MHz
X?#2  32.768KHz
X?#3  (no value)
X?#4  (no value)

### Nets
+3V3: FB?#3.2 R?#144.2 R?#145.2 R?#147.2 R?#148.2 R?#149.2 R?#150.2 X?#3.3 X?#4.1
GND: C?#40.2 C?#41.2 C?#42.2 C?#43.2 C?#44.2 C?#45.2 C?#46.2 C?#47.2 C?#48.2 C?#49.2 C?#50.2 C?#51.2 C?#52.2 C?#53.2 C?#54.2 C?#55.2 C?#56.2 C?#57.2 C?#58.2 C?#59.2 C?#60.2 C?#61.2 C?#62.2 R?#152.1 U?#13.D2(GNDIO0) U?#13.F6(GNDIO7) U?#13.F9(GNDIO6) U?#13.G10(GNDIO5) U?#13.H6(GNDANA0) U?#13.J6(GNDIO1) U?#13.J10(GNDIO4) U?#13.K8(GNDIO2) U?#13.K9(GNDIO3) U?#14.2(GND) X?#1.2(GND) X?#1.4(GND) X?#3.1 X?#4.3 X?#4.5 X?#4.9
DEBUG_UART3.CTS: X?#3.6
DEBUG_UART3.RTS: X?#3.2
DEBUG_UART3.RXD: X?#3.4
DEBUG_UART3.TXD: X?#3.5
MCU_RESETn: R?#147.1 U?#12.A8(~{RESET}) U?#14.1(~{RESET}) X?#4.10
SWD.CLK: X?#4.4
SWD.DIO: X?#4.2
NetC?#40_1: C?#40.1 C?#41.1 L?.1 U?#13.A7(VDDCORE)
NetC?#42_1: C?#42.1 C?#43.1 C?#44.1 FB?#3.1 U?#13.G6(VDDANA0) U?#13.M2(VDDANA1)
NetC?#45_1: C?#45.1 U?#12.R14(PA15_/_XOUT) X?#1.3(OSC2)
NetC?#46_1: C?#46.1 U?#12.R13(PA14_/_XIN) X?#1.1(OSC1)
NetC?#47_1: C?#47.1 U?#12.B1(PA01_/_XOUT32) X?#2.2(OSC2)
NetC?#48_1: C?#48.1 U?#12.A1(PA00_/_XIN32) X?#2.1(OSC1)
NetC?#49_1: C?#49.1 C?#50.1 R?#144.1 U?#13.K6(VDDIOB1) U?#13.K7(VDDIOB2)
NetC?#51_1: C?#51.1 C?#52.1 C?#53.1 C?#54.1 C?#55.1 C?#56.1 C?#57.1 C?#58.1 R?#145.1 U?#13.F7(VDDIO7) U?#13.F8(VDDIO6) U?#13.F10(VDDIO5) U?#13.H10(VDDIO4) U?#13.K10(VDDIO3)
NetC?#59_1: C?#59.1 R?#148.1 U?#14.6(VDD)
NetC?#60_1: C?#60.1 R?#149.1 R?#151.1 U?#14.3(~{MR})
NetC?#61_1: C?#61.1 R?#150.1 R?#152.2 U?#14.5(SENSE)
NetC?#62_1: C?#62.1 U?#14.4(CT)
NetL?_2: L?.2 U?#13.A6(VSW)

Not connected (* = marked no-connect by the designer): R?#146 1 2; R?#151 2; U?#12 B6(SWDIO_/_PA31) B7(SWCLK_/_PA30); X?#4 6* 7* 8*

### Notes on the sheet
- ID000 - MCU Power and Subsystem controllers
- UART DEBUG CONNECTOR
- TTL_232R_RTS
- GND
- TTL_232R_CTS
- TTL_232R_TXD
- TTL_232R_RXD
- VCC
- RESET SUPERVISOR
- SWD DEBUG CONNECTOR
- Title:
- Size:
- Date:
- A3
- Sheet       of
- Engineer:
- Version:
- Part Number:
- Revision:
- Rev. date:
- Project:
- File:
- (in symbol 10Pin SWD Interface) SWD; Debug Connector; VTarget; SWDIO; GND; SWCLK; SWO; KEY; NC/EXTb; nRESET

### Library data of the parts
C?#40-C?#62 = Ceramic: Ceramic CAP Symbol
FB?#3 = Ferrite Bead: Ferrite Bead Symbol
L? = Inductor: Inductor Symbol
R?#144-R?#152 = Resistor: Resistor Symbol
U?#12 U?#13 = ATMEL_ATSAME54P20A-CT_A: as U?#10 on sheet LIDO-HW.100.Page_9
U?#14 = TI_TPS3808_A: IC SUPERVISOR 1 CHANNEL SOT23-6; Manufacturer: Texas Instruments; Manufacturer Part Number: TPS3808G01DBVR; Designer: Matt Drazenovich; Ratings: RoHS; Reviewed: Dekimo_30-06-2020; Case/Package: SOT-23-6; ComponentType: IC; Design Date: 04-11-2019; Max Operating Temperature: 125°C; Min Operating Temperature: -40°C; Value: TPS3808G01
X?#1 = XTAL_4Pins_A: Crystal with Four Pins, / X - 1 & 3 / GND - 2 & 4
X?#2 = XTAL 2Pins: Crystal with two pins
X?#3 = RECT_6pin_A: Rectengular connector, 6 pins, Version A
X?#4 = 10Pin SWD Interface: 10Pin Serial Wire Debug Interface  header SMT

## Nets that join several sheets
+3V3: LIDO-HW.100.Page_5 (5 pins), LIDO-HW.100.Page_6 (12 pins), LIDO-HW.100.Page_7 (5 pins), LIDO-HW.100.Page_8 (5 pins), LIDO-HW.100.Page_9 (R?#140.2 R?#141.2), LIDO-HW.100.Page_10 (9 pins)
+5V0: LIDO-HW.100.Page_5 (10 pins), LIDO-HW.100.Page_6 (C?#22.1 C?#23.1 R?#27.1 U?#4.3), LIDO-HW.100.Page_7 (C?#30.1 C?#31.1 U?#6.3)
GND: LIDO-HW.100.Page_5 (24 pins), LIDO-HW.100.Page_6 (17 pins), LIDO-HW.100.Page_7 (11 pins), LIDO-HW.100.Page_8 (6 pins), LIDO-HW.100.Page_9 (R?#142.1 R?#143.1), LIDO-HW.100.Page_10 (40 pins)